# EasyEDA Pro project ProPrj_openfpv.epro

# Schematic Schematic1
Board Name: Board1; Create Date: 2025-07-27; Page Name: P1; Project Name: openfpv; Schematic Name: Schematic1; Update Date: 2025-07-27; Company: EasyEDA.com; Page Size: A4; Version: V1.0
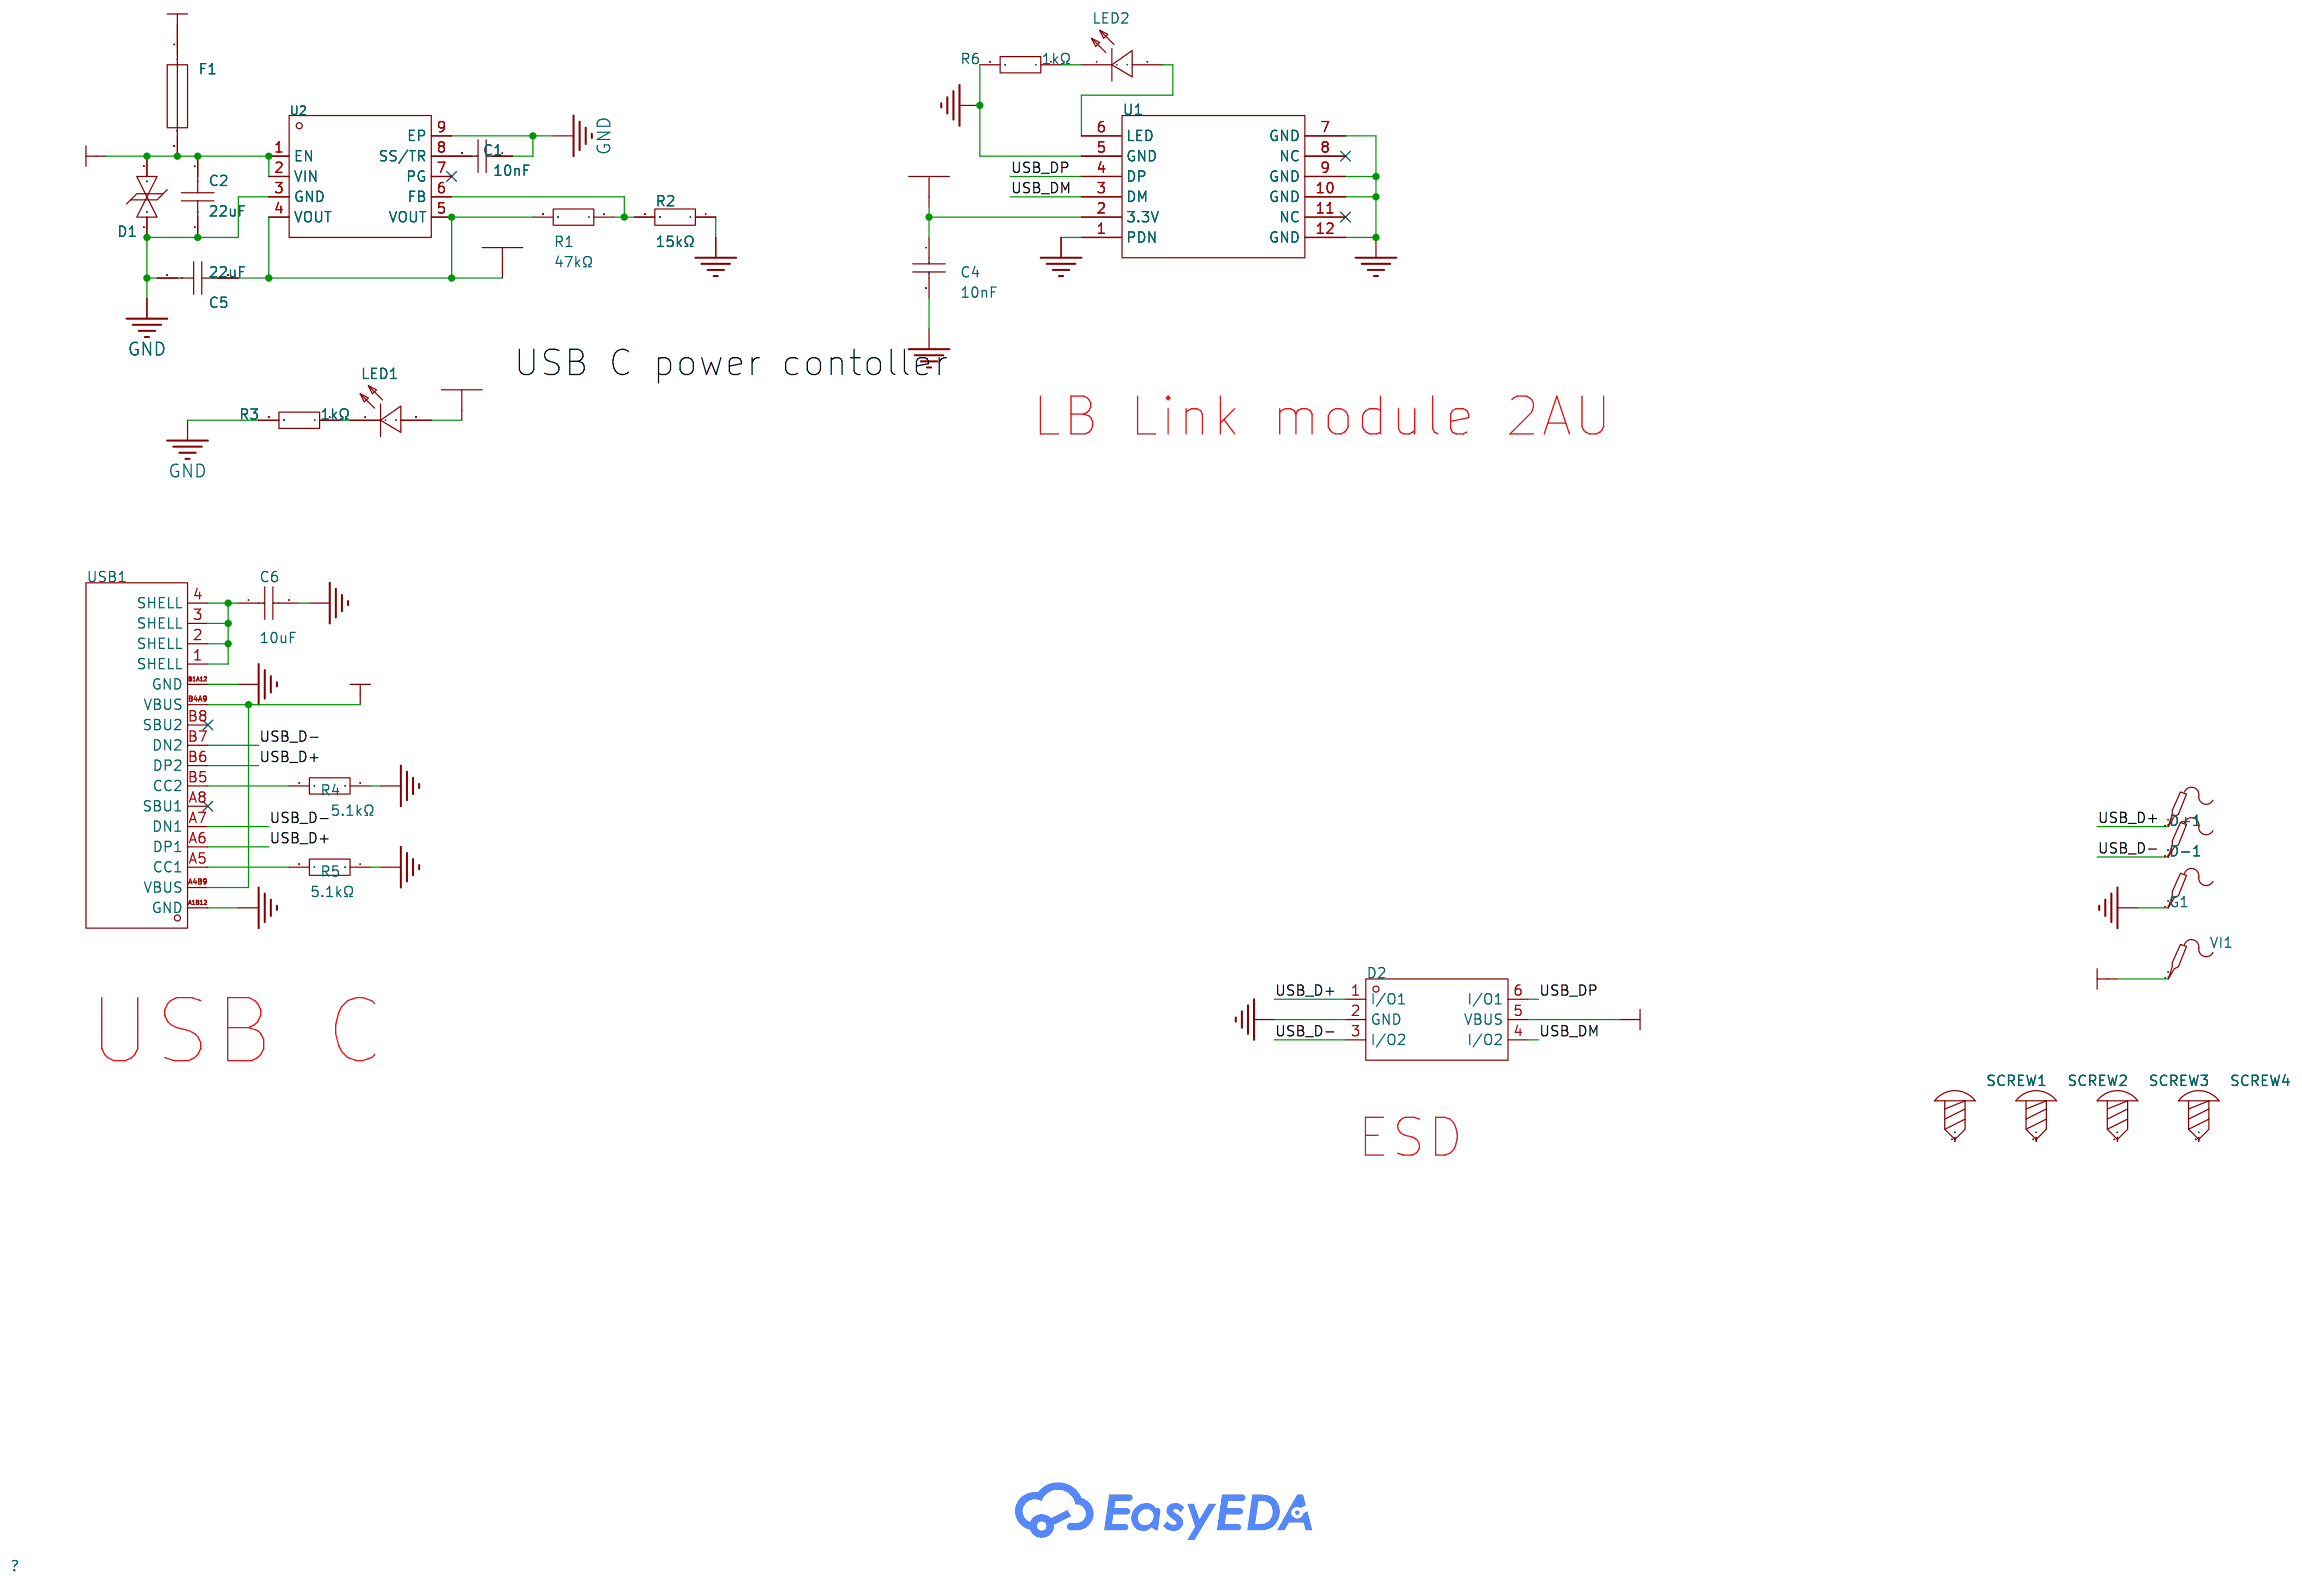
[diagram p0: schematic sheet]

## Parts
C1  10nF  [C0402]
C2  22uF  [C0805]
C4  10nF  [C0402]
C5  22uF  [C0805]
C6  10uF  [C0603]
D1  PESD12VL1BA-N  [SOD-323_L1.8-W1.3-LS2.5-BI]
D2  USBLC6-2P6  [SOT-666-6_L1.6-W1.2-P0.50-LS1.6-BL]
D+1  -  [Test-Point-0.5mm]
D-1  -  [Test-Point-0.5mm]
F1  BSMD0805-075-12V  [F0805]
G1  -  [Test-Point-0.5mm]
LED1  NCD0603R1  [LED0603-RD_RED]
LED2  NCD0603G1  [LED0603-RD]
R1  47kΩ  [R0402]
R2  15kΩ  [R0402]
R3  1kΩ  [R0402]
R4  5.1kΩ  [R0603]
R5  5.1kΩ  [R0603]
R6  1kΩ  [R0402]
SCREW1  -  [M2螺丝]
SCREW2  -  [M2螺丝]
SCREW3  -  [M2螺丝]
SCREW4  -  [M2螺丝]
U1  -  [BL-R8812AF1-C]
U2  TPS82130SILR  [USIP-8_L3.0-W2.8-P0.65-TL-EP]
USB1  TYPE-C16PIN  [USB-C-SMD_TYPE-C16PIN]
VI1  -  [Test-Point-0.5mm]

## Library data of the parts
C1 C4 = CL05B103KB5NNNC: 容值:10nF;精度:±10%;额定电压:50V;材质(温度系数):X7R;; LCSC Part Name: 10nF ±10% 50V; Supplier Part: C15195; Manufacturer: SAMSUNG(三星); Supplier Footprint: 0402; JLCPCB Part Class: Basic Part; Datasheet: https://atta.szlcsc.com/upload/public/pdf/source/20160218/1457707763339.pdf; Supplier: LCSC; Tolerance: ±10%; Voltage Rated: 50V; Temperature Coefficient: X7R
C2 C5 = CL21A226MAQNNNE: 容值:22uF;精度:±20%;额定电压:25V;材质(温度系数):X5R;; LCSC Part Name: 22uF ±20% 25V; Supplier Part: C45783; Manufacturer: SAMSUNG(三星); Supplier Footprint: 0805; JLCPCB Part Class: Basic Part; Datasheet: https://atta.szlcsc.com/upload/public/pdf/source/20160218/1457707763339.pdf; Supplier: LCSC; Tolerance: ±20%; Voltage Rated: 25V; Temperature Coefficient: X5R; Rated Current: 1.4A; Saturation Current (Isat): 1.6A; DC Resistance (DCR): 176mΩ
C6 = CC0603MRX5R6BB106: 容值:10uF;精度:±20%;额定电压:10V;材质(温度系数):X5R;; LCSC Part Name: 10uF ±20% 10V; Supplier Part: C109453; Manufacturer: YAGEO(国巨); Supplier Footprint: 0603; JLCPCB Part Class: Extended Part; Datasheet: https://atta.szlcsc.com/upload/public/pdf/source/20180326/C109453_72B4C2260F588BCE3D54F60D5FB06765.pdf; Supplier: LCSC; Tolerance: ±20%; Voltage Rated: 10V; Temperature Coefficient: X5R
D1 = PESD12VL1BA-N: 极性:双向;反向截止电压(Vrwm):12V;最大钳位电压:26V;峰值脉冲电流(Ipp)@10/1000us:10A;击穿电压:13.3V;; LCSC Part Name: 双向ESD; Supplier Part: C314261; Manufacturer: BORN(伯恩半导体); Supplier Footprint: SOD-323; Datasheet: https://atta.szlcsc.com/upload/public/pdf/source/20181015/C314261_4290A578F6A9FDD8EB59F3EEFCEB14F5.pdf; Supplier: LCSC; polarity: 双向; Reverse Stand-Off Voltage (Vrwm): 12V; Maximum Clamping Voltage: 26V; Peak Pulse Current (Ipp)@10/1000us: 10A; Breakdown Voltage: 13.3V; Type: ESD
D2 = USBLC6-2P6_C2827693: 极性：Unidirectional 反向关断电压（典型值）：5.25V 击穿电压（最小值）：6V 箝位电压：17V 峰值脉冲电流（10/1000us）：4A 二极管阵列 TVS USB2 二极管类型: 单向TVS 钳位电压 最大: 17V 二极管封装形式: SOT-666; LCSC Part Name: MSL=3; Supplier Part: C2827693; Manufacturer: TECH PUBLIC(台舟); Supplier Footprint: SOT-666-6; JLCPCB Part Class: 扩展库; Datasheet: https://atta.szlcsc.com/upload/public/pdf/source/20210810/36353A9194EA9F4E33F8AE18BE051AEA.pdf; Supplier: LCSC
D+1 D-1 G1 VI1 = Test-Point: Test Point 测试点
F1 = BSMD0805-075-12V: 最大电压:12V;最大电流:40A;保持电流:750mA;跳闸电流:1.5A;; LCSC Part Name: 12V 750mA 0805自恢复; Supplier Part: C883111; Manufacturer: BHFUSE(佰宏); Supplier Footprint: 0805; JLCPCB Part Class: 扩展库; Datasheet: https://atta.szlcsc.com/upload/public/pdf/source/20230512/7A46D6CD923C15CBB98FD769C08EDD80.pdf; Supplier: LCSC; Operating Voltage (Max): 12V; Current Rating (Max): 40A; Hold Current: 750mA; Trip Current: 1.5A; Power Dissipation: 600mW; Resistance - Initial (Ri) (Min): 70mΩ; Resistance - Post Trip (R1) (Max): 385mΩ; Maximum Time to Trip: 200ms; Operating Temperature: -40℃~+85℃
LED1 = NCD0603R1_C84263: 灯头类型:-;发光颜色:红色;正向电压(VF):1.6V~2.6V;功率:65mW;正向电流:20mA;主波长:615nm~630nm;二极管配置:独立二极管;透镜颜色:无色透明透镜;色温:-;发光强度:80mcd~220mcd;发光角度:130°;载带方式:-;工作温度:-30℃~+85℃;; Supplier Part: C84263; Manufacturer: 国星光电; Supplier Footprint: 0603; JLCPCB Part Class: Extended Part; Datasheet: https://atta.szlcsc.com/upload/public/pdf/source/20200820/C84263_DABC6A75E58F576973B407FDBA283D60.pdf; Supplier: LCSC; Emitted Color: 红色; Forward Voltage (VF): 1.6V~2.6V; Power Dissipation: 65mW; Forward Current: 20mA; Dominant Wavelength: 615nm~630nm; Diode Configuration: 独立二极管; Lens Color: 无色透明透镜; Luminous Intensity: 80mcd~220mcd; Viewing Angle: 130°; Operating Temperature: -30℃~+85℃
LED2 = NCD0603G1: 发光颜色:翠绿色;正向电压(VF):2.6V~3.6V;功率:72mW;正向电流:10mA;主波长:515nm~530nm;透镜颜色:无色透明透镜;发光强度:330mcd~900mcd;发光角度:130°;工作温度:-30℃~+85℃;; Supplier Part: C84267; Manufacturer: 国星光电; Supplier Footprint: 0603; JLCPCB Part Class: Extended Part; Datasheet: https://atta.szlcsc.com/upload/public/pdf/source/20200820/C84267_04BA7703640BAC111D09F5EFB971FBF3.pdf; Supplier: LCSC; Emitted Color: 翠绿色; Forward Voltage (VF): 2.6V~3.6V; Power Dissipation: 72mW; Forward Current: 10mA; Dominant Wavelength: 515nm~530nm; Lens Color: 无色透明透镜; Luminous Intensity: 330mcd~900mcd; Viewing Angle: 130°; Operating Temperature: -30℃~+85℃; Peak Wavelength: 591nm
R1 = 0402WGF4702TCE: 电阻类型:厚膜电阻;阻值:47kΩ;精度:±1%;功率:62.5mW;最大工作电压:50V;温度系数:±100ppm/℃;; LCSC Part Name: 47kΩ ±1% 62.5mW 厚膜电阻; Supplier Part: C25792; Manufacturer: UNI-ROYAL(厚声); Supplier Footprint: 0402; JLCPCB Part Class: Basic Part; Datasheet: https://atta.szlcsc.com/upload/public/pdf/source/20200306/C422600_1E6D84923E4A46A82E41ADD87F860B5C.pdf; Supplier: LCSC; Type: 厚膜电阻; Tolerance: ±1%; Power(Watts): 62.5mW; Overload Voltage (Max): 50V; Temperature Coefficient: ±100ppm/℃; Operating Temperature Range: -55℃~+155℃; Voltage Rated: 50V
R2 = 0402WGF1502TCE: 电阻类型:厚膜电阻;阻值:15kΩ;精度:±1%;功率:62.5mW;最大工作电压:50V;温度系数:±100ppm/℃;; LCSC Part Name: 15kΩ ±1% 62.5mW 厚膜电阻; Supplier Part: C25756; Manufacturer: UNI-ROYAL(厚声); Supplier Footprint: 0402; JLCPCB Part Class: Basic Part; Datasheet: https://atta.szlcsc.com/upload/public/pdf/source/20200306/C422600_1E6D84923E4A46A82E41ADD87F860B5C.pdf; Supplier: LCSC; Type: 厚膜电阻; Tolerance: ±1%; Power(Watts): 62.5mW; Overload Voltage (Max): 50V; Temperature Coefficient: ±100ppm/℃; Operating Temperature Range: -55℃~+155℃; Voltage Rated: 50V
R3 R6 = 0402WGF1001TCE: 电阻类型:厚膜电阻;阻值:1kΩ;精度:±1%;功率:62.5mW;最大工作电压:50V;温度系数:±100ppm/℃;; LCSC Part Name: 1kΩ ±1% 62.5mW 厚膜电阻; Supplier Part: C11702; Manufacturer: UNI-ROYAL(厚声); Supplier Footprint: 0402; JLCPCB Part Class: Basic Part; Datasheet: https://atta.szlcsc.com/upload/public/pdf/source/20200306/C422600_1E6D84923E4A46A82E41ADD87F860B5C.pdf; Supplier: LCSC; Type: 厚膜电阻; Tolerance: ±1%; Power(Watts): 62.5mW; Overload Voltage (Max): 50V; Temperature Coefficient: ±100ppm/℃; Operating Temperature Range: -55℃~+155℃; Voltage Rated: 50V
R4 R5 = AC0603FR-075K1L: 电阻类型:厚膜电阻;阻值:5.1kΩ;精度:±1%;功率:100mW;; LCSC Part Name: 5.1kΩ ±1% 100mW; Supplier Part: C125891; Manufacturer: YAGEO(国巨); Supplier Footprint: 0603; JLCPCB Part Class: Extended Part; Datasheet: https://atta.szlcsc.com/upload/public/pdf/source/20171221/C125891_15138310074731195201.pdf; Supplier: LCSC; Type: 厚膜电阻; Tolerance: ±1%; Power(Watts): 100mW; Temperature Coefficient: ±100ppm/℃; Overload Voltage (Max): 75V; Operating Temperature Range: -55℃~+155℃
SCREW1-SCREW4 = M2螺丝: Supplier Footprint: 插件
U1 = BL-R8812AF1
U2 = TPS82130SILR: 输入电压(DC):3V~17V;输出电压:900mV~6V;输出电流(最大值):3A;功能类型:-;; Supplier Part: C473914; Manufacturer: TI(德州仪器); Supplier Footprint: USIP-8; JLCPCB Part Class: 扩展库; Datasheet: https://www.ti.com/cn/lit/gpn/tps82130; Supplier: LCSC; Input Voltage(DC): 3V~17V; Output Voltage: 900mV~6V; Output Current (Max): 3A; Output Channel: 1
USB1 = TYPE-C16PIN: 连接器类型:Type-C;标准:-;公母:母;端口数量:1;触点数量:16P;安装方式:卧贴;额定电流 - 电源:3A;工作温度范围:-40℃~+85℃;; LCSC Part Name: Type-C 母 卧贴; Supplier Part: C393939; Manufacturer: SHOU HAN(首韩); Supplier Footprint: SMD; JLCPCB Part Class: 扩展库; Datasheet: https://atta.szlcsc.com/upload/public/pdf/source/20190521/C393939_7B9043D4CF1026AF443AB60D91FBCD5C.pdf; Supplier: LCSC; Connector Type: Type-C; Gender: 母; Number of Ports: 1; Number of Contacts: 16P; Mounting Style: 卧贴; Current Rating - Power (Max): 3A; Operating Temperature Range: -40℃~+85℃

## Nets
3V3: C4.1 C5.2 LED1.2(A) R1.2 U1.2(3.3V) U2.4(VOUT) U2.5(VOUT)
GND: C1.1 C2.2 C4.2 C5.1 C6.1 D1.1 D2.2(GND) G1.1 R2.1 R3.2 R4.1 R5.1 R6.2 U1.1(PDN) U1.5(GND) U1.7(GND) U1.9(GND) U1.10(GND) U1.12(GND) U2.3(GND) U2.9(EP) USB1.A1B12(GND) USB1.B1A12(GND)
VIN_CON: F1.1 VI1.1
USB_D+: D2.1(I/O1) D+1.1 USB1.A6(DP1) USB1.B6(DP2)
USB_D-: D2.3(I/O2) D-1.1 USB1.A7(DN1) USB1.B7(DN2)
USB_DM: D2.4(I/O2) U1.3(DM)
USB_DP: D2.6(I/O1) U1.4(DP)
USB_VBUS: C2.1 D1.2 D2.5(VBUS) F1.2 U2.1(EN) U2.2(VIN) USB1.A4B9(VBUS) USB1.B4A9(VBUS)
$1N1281: LED1.1(K) R3.1
$1N1283: R1.1 R2.2 U2.6(FB)
$1N1284: C1.2 U2.8(SS/TR)
$1N1301: R5.2 USB1.A5(CC1)
$1N1302: R4.2 USB1.B5(CC2)
$1N1320: LED2.1(K) R6.1
$1N1321: LED2.2(A) U1.6(LED)
$1N1322: C6.2 USB1.1(SHELL) USB1.2(SHELL) USB1.3(SHELL) USB1.4(SHELL)

Not connected (* = marked no-connect by the designer): SCREW1 1; SCREW2 1; SCREW3 1; SCREW4 1; U1 8(NC)* 11(NC)*; U2 7(PG)*; USB1 A8(SBU1)* B8(SBU2)*

## Notes on the sheet
- USB C power contoller
- LB Link module 2AU
- USB C
- ESD

# Schematic Schematic2
Board Name: air; Create Date: 2025-07-31; Page Name: P1; Project Name: openfpv; Schematic Name: Schematic2; Update Date: 2025-07-31; Company: EasyEDA.com; Page Size: A4; Version: V1.0
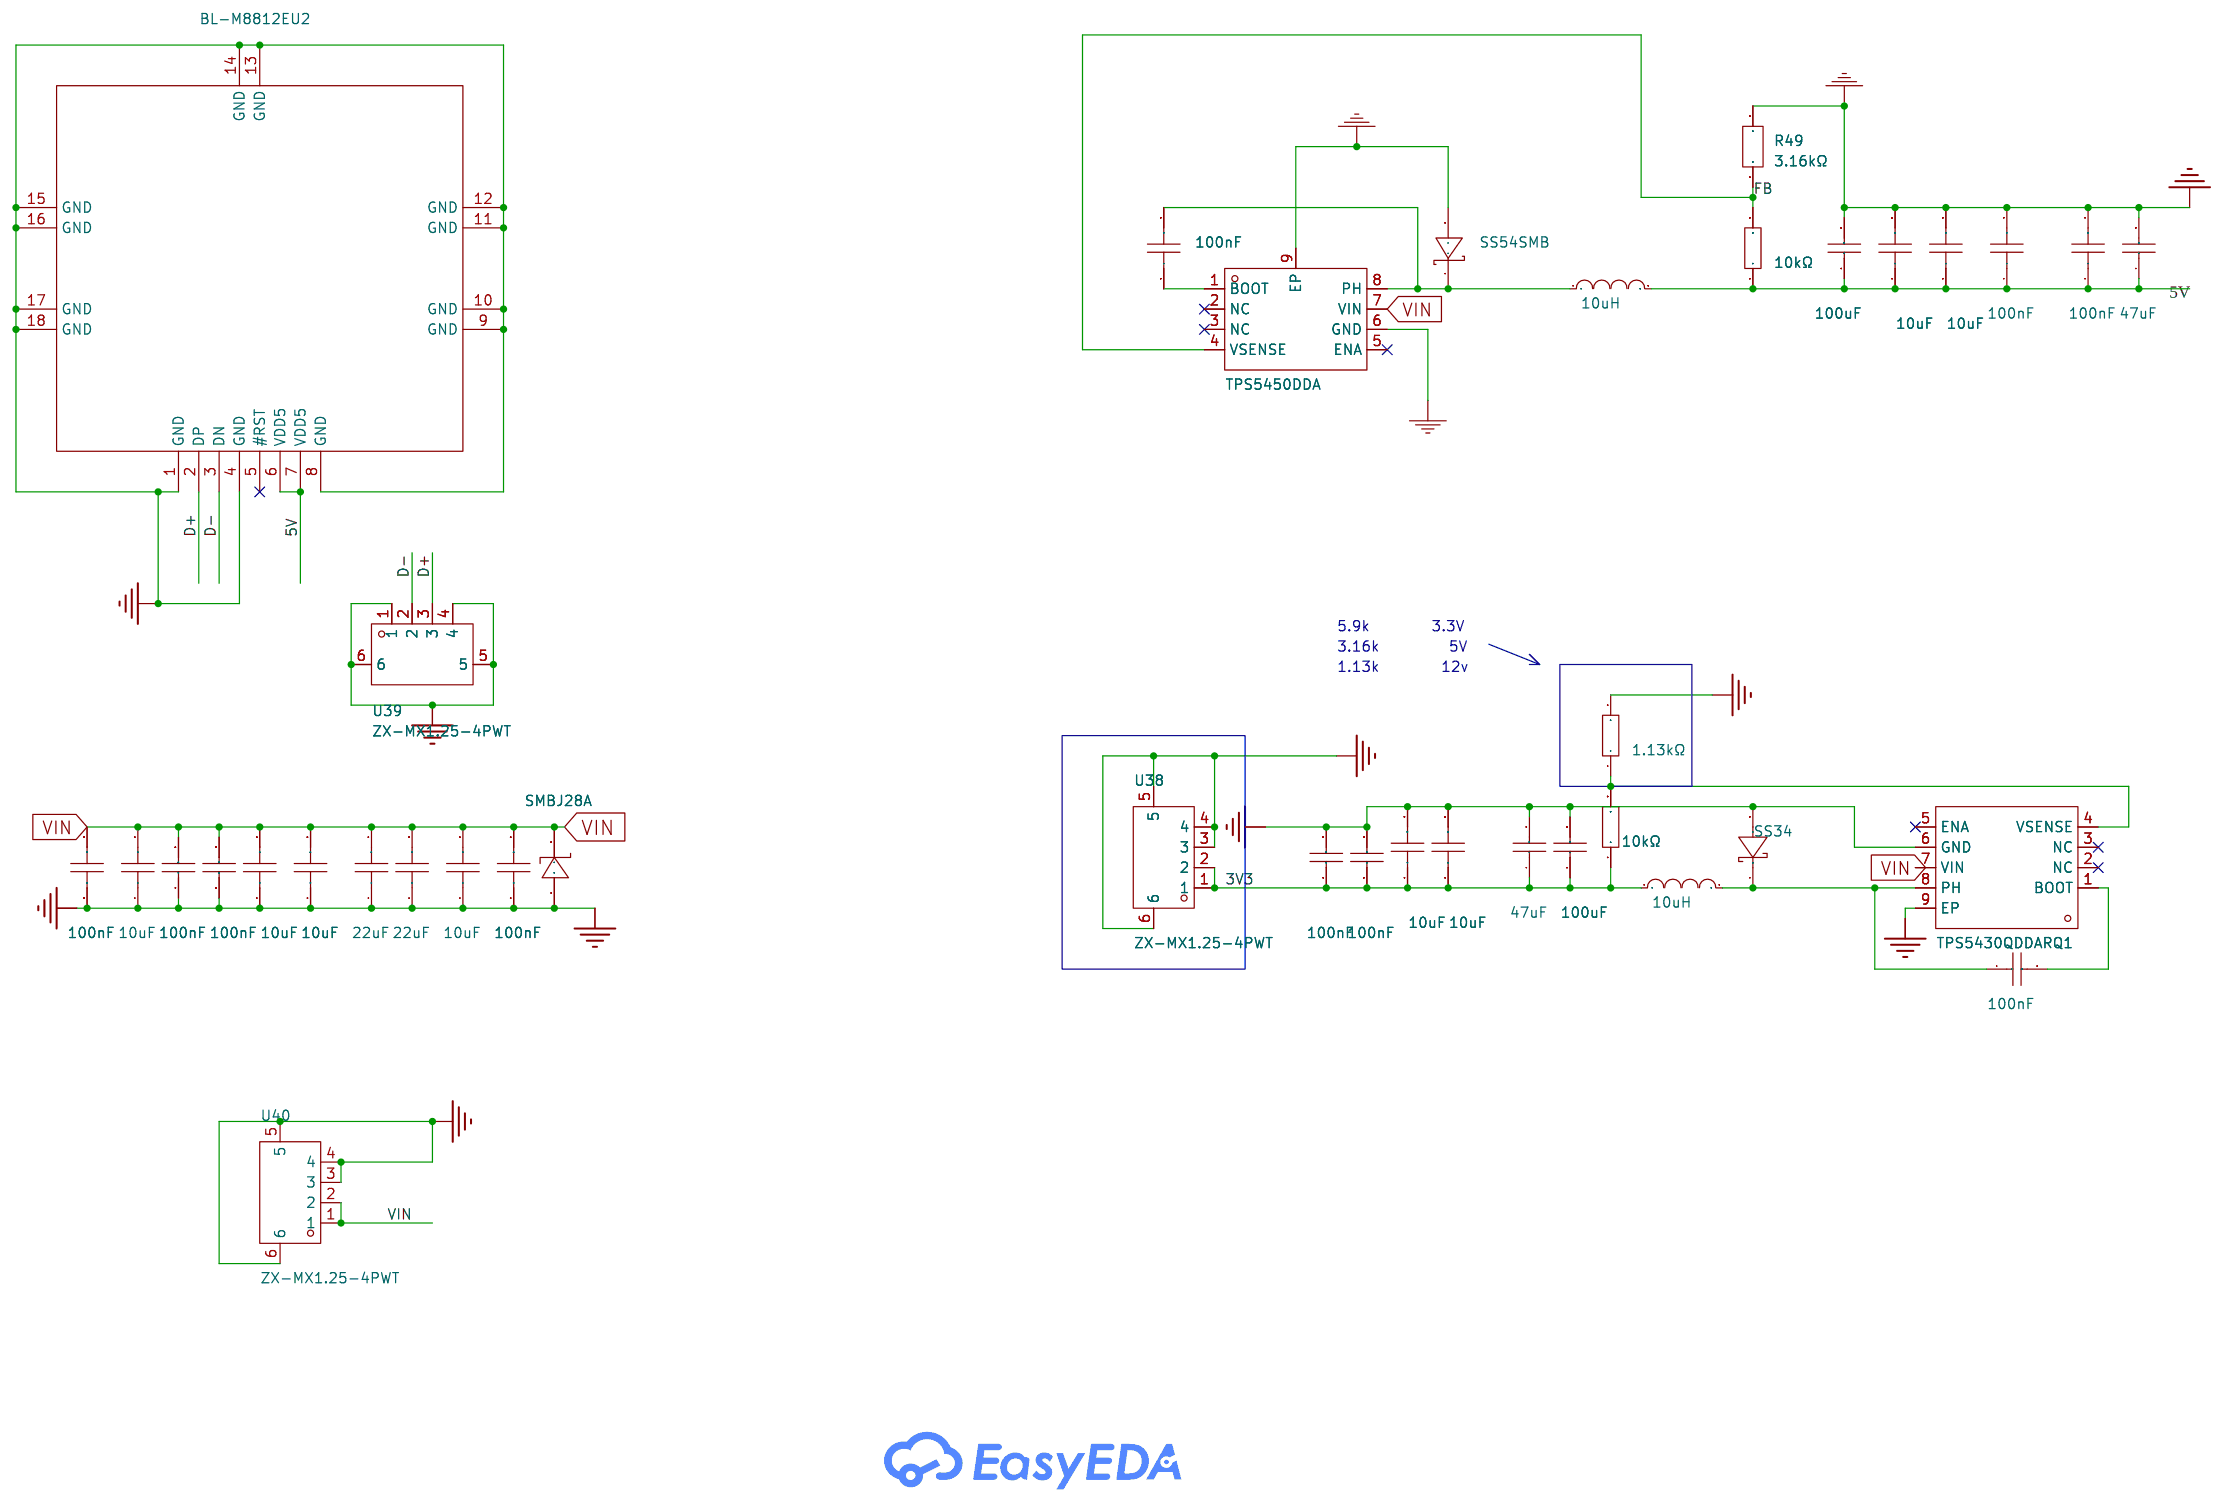
[diagram p1: schematic sheet]

## Parts
C100  100nF  [C0603]
C143  100nF  [C0603]
C152  100nF  [C0603]
C157  100nF  [C0603]
C158  100nF  [C0603]
C159  47uF  [C0603]
C161  22uF  [C0805]
C167  100nF  [C0603]
C176  10uF  [C0603]
C177  10uF  [C0603]
C178  100uF  [C1206]
C179  100uF  [C1206]
C186  10uF  [C0603]
C187  10uF  [C0603]
C189  100nF  [C0603]
C191  22uF  [C0805]
C192  100nF  [C0805]
C193  100nF  [C0805]
C196  10uF  [C0805]
C197  10uF  [C0805]
C199  100nF  [C0603]
C200  47uF  [C0603]
C201  10uF  [C0603]
D3  SMBJ28A  [SMB_L4.6-W3.6-LS5.3-L-FD]
D4  SS54SMB  [SMB_L4.6-W3.6-LS5.3-RD]
D5  SS34  [SMA_L4.3-W2.5-LS5.0-RD]
L11  10uH  [IND-SMD_L5.4-W5.2_FXL0530]
L12  10uH  [IND-SMD_L5.4-W5.2_FXL0530]
R47  10kΩ  [R0603]
R48  10kΩ  [R0603]
R49  3.16kΩ  [R0603]
R50  1.13kΩ  [R0603]
U11  TPS5450DDA  [SOP-8_L4.9-W3.9-P1.27-LS6.0-TL-EP-1]
U16  BL-M8812EU2  [BL-M8812EU2]
U28  TPS5430QDDARQ1  [SOPOWERPAD-8_L4.9-W3.9-P1.27-LS6.0-BL-EP]
U38  ZX-MX1.25-4PWT  [CONN-SMD_4P-P1.25-MX1.25-4P-WT]
U39  ZX-MX1.25-4PWT  [CONN-SMD_4P-P1.25-MX1.25-4P-WT]
U40  ZX-MX1.25-4PWT  [CONN-SMD_4P-P1.25-MX1.25-4P-WT]
U41  10uF  [C0603]

## Library data of the parts
C100 C157 C158 = CC0603KRX7R9BB104: 容值:100nF;精度:±10%;额定电压:50V;材质(温度系数):X7R;; LCSC Part Name: 100nF ±10% 50V; Supplier Part: C14663; Manufacturer: YAGEO(国巨); Supplier Footprint: 0603; JLCPCB Part Class: 基础库; Datasheet: https://atta.szlcsc.com/upload/public/pdf/source/20180910/C282072_33301C7F631E79921B82A8DAC6BCC5B3.pdf; Supplier: LCSC; Tolerance: ±10%; Voltage Rated: 50V; Temperature Coefficient: X7R
C143 C152 C167 = 0603B104K500NT: 容值:100nF;精度:±10%;额定电压:50V;材质(温度系数):X7R;; LCSC Part Name: 100nF ±10% 50V; Supplier Part: C30926; Manufacturer: FH(风华); Supplier Footprint: 0603; JLCPCB Part Class: 扩展库; Datasheet: https://atta.szlcsc.com/upload/public/pdf/source/20170923/C30926_1506149436298988724.pdf; Supplier: LCSC; Tolerance: ±10%; Voltage Rated: 50V; Temperature Coefficient: X7R
C159 C200 = GRM188R60J476ME15D: 容值:47uF;精度:±20%;额定电压:6.3V;材质(温度系数):X5R;; LCSC Part Name: 47uF ±20% 6.3V; Supplier Part: C140782; Manufacturer: muRata(村田); Supplier Footprint: 0603; JLCPCB Part Class: 扩展库; Datasheet: https://atta.szlcsc.com/upload/public/pdf/source/20171113/C140782_15105612981581115778.pdf; Supplier: LCSC; Tolerance: ±20%; Voltage Rated: 6.3V; Temperature Coefficient: X5R
C161 C191 = CGA0805X5R226M350MT: 容值:22uF;精度:±20%;额定电压:35V;材质(温度系数):X5R;; LCSC Part Name: 22uF ±20% 35V; Supplier Part: C6119901; Manufacturer: HRE(芯声); Supplier Footprint: 0805; JLCPCB Part Class: Extended Part; Supplier: LCSC; Tolerance: ±20%; Voltage Rated: 35V; Temperature Coefficient: X5R
C176 C177 C186 C187 C201 = CL10A106KP8NNNC: 容值:10uF;精度:±10%;额定电压:10V;材质(温度系数):X5R;; LCSC Part Name: 10uF ±10% 10V; Supplier Part: C19702; Manufacturer: SAMSUNG(三星); Supplier Footprint: 0603; JLCPCB Part Class: 基础库; Datasheet: https://atta.szlcsc.com/upload/public/pdf/source/20160218/1457707763339.pdf; Supplier: LCSC; Tolerance: ±10%; Voltage Rated: 10V; Temperature Coefficient: X5R
C178 C179 = CL31A107MQHNNNE: 容值:100uF;精度:±20%;额定电压:6.3V;材质(温度系数):X5R;; LCSC Part Name: 100uF ±20% 6.3V; Supplier Part: C15008; Manufacturer: SAMSUNG(三星); Supplier Footprint: 1206; JLCPCB Part Class: 基础库; Datasheet: https://atta.szlcsc.com/upload/public/pdf/source/20160218/1457707763339.pdf; Supplier: LCSC; Tolerance: ±20%; Voltage Rated: 6.3V; Temperature Coefficient: X5R
C189 C199 = CGA0603X7R104K500JT: 容值:100nF;精度:±10%;额定电压:50V;材质(温度系数):X7R;; LCSC Part Name: 100nF ±10% 50V; Supplier Part: C6119867; Manufacturer: HRE(芯声); Supplier Footprint: 0603; JLCPCB Part Class: 扩展库; Supplier: LCSC; Tolerance: ±10%; Voltage Rated: 50V; Temperature Coefficient: X7R
C192 C193 = CC0805KRX7R9BB104: 容值:100nF;精度:±10%;额定电压:50V;材质(温度系数):X7R;; LCSC Part Name: 100nF ±10% 50V; Supplier Part: C49678; Manufacturer: YAGEO(国巨); Supplier Footprint: 0805; JLCPCB Part Class: 基础库; Datasheet: https://atta.szlcsc.com/upload/public/pdf/source/20180224/C181747_15194369449651363981.pdf; Supplier: LCSC; Tolerance: ±10%; Voltage Rated: 50V; Temperature Coefficient: X7R
C196 C197 = CGA0805X5R106K350MT: 容值:10uF;精度:±10%;额定电压:35V;材质(温度系数):X5R;; LCSC Part Name: 10uF ±10% 35V; Supplier Part: C6119888; Manufacturer: HRE(芯声); Supplier Footprint: 0805; JLCPCB Part Class: 扩展库; Supplier: LCSC; Tolerance: ±10%; Voltage Rated: 35V; Temperature Coefficient: X5R
D3 = SMBJ28A: 极性:Unidirectional;峰值脉冲电流（10/1000us）:13.2A;箝位电压:45.4V;击穿电压（最小值）:31.1V;反向关断电压（典型值）:28V;; Supplier Part: C356769; Manufacturer: JJW(捷捷微); Supplier Footprint: SMB(DO-214AA); JLCPCB Part Class: 扩展库; Datasheet: https://atta.szlcsc.com/upload/public/pdf/source/20181226/C356769_111367A690C2F4EEBB1E8F2BF22E2686.pdf; Supplier: LCSC
D4 = SS54SMB: schottky,5A 40V VF&lt;0.55V DO-214AA SMB; LCSC Part Name: SS54 SMB; Supplier Part: C511854; Manufacturer: BORN(伯恩半导体); Supplier Footprint: SMB; JLCPCB Part Class: 扩展库; Datasheet: https://atta.szlcsc.com/upload/public/pdf/source/20200413/C511854_F7D668554D39129E820C7896E4694DA5.pdf; Supplier: LCSC
D5 = SS34_C727060: 二极管配置:独立式;正向压降(Vf):550mV@3A;直流反向耐压(Vr):40V;平均整流电流(Io):3A;; LCSC Part Name: 电压:40V 电流:3A; Supplier Part: C727060; Manufacturer: TWGMC(台湾迪嘉); Supplier Footprint: SMA(DO-214AC); JLCPCB Part Class: 扩展库; Datasheet: https://atta.szlcsc.com/upload/public/pdf/source/20200828/C727059_6599B6CAC5F3238B9C33E46794659DBE.pdf; Supplier: LCSC; Diode Configuration: 独立式; Forward Voltage (Vf@If): 550mV@3A; Reverse Voltage (Vr): 40V; Average Rectified Current (Io): 3A; Reverse Leakage Current (Ir): 500uA@40V
L11 L12 = FXL0530-100-M: 电感值:10uH;精度:±20%;额定电流:3.2A;饱和电流(Isat):3.5A;类型:一体成型电感;; LCSC Part Name: 10uH ±20% 3.5A; Supplier Part: C177248; Manufacturer: cjiang(长江微电); Supplier Footprint: SMD,5.2x5.4mm; JLCPCB Part Class: 扩展库; Datasheet: https://atta.szlcsc.com/upload/public/pdf/source/20230516/4BF6F9C76E81720F52A39ED5FFFA18B4.pdf; Supplier: LCSC; Tolerance: ±20%; Rated Current: 3.2A; Saturation Current (Isat): 3.5A; DC Resistance (DCR): 125mΩ; Type: 一体成型电感
R47 R48 = 0603WAF1002T5E: 电阻类型:厚膜电阻;阻值:10kΩ;精度:±1%;功率:100mW;最大工作电压:75V;温度系数:±100ppm/℃;; LCSC Part Name: 厚膜电阻 10kΩ ±1% 100mW; Supplier Part: C25804; Manufacturer: UNI-ROYAL(厚声); Supplier Footprint: 0603; JLCPCB Part Class: 基础库; Datasheet: https://atta.szlcsc.com/upload/public/pdf/source/20200306/C422600_1E6D84923E4A46A82E41ADD87F860B5C.pdf; Supplier: LCSC; Type: 厚膜电阻; Tolerance: ±1%; Power(Watts): 100mW; Overload Voltage (Max): 75V; Temperature Coefficient: ±100ppm/℃; Operating Temperature Range: -55℃~+155℃
R49 = FRC0603F3161TS: 电阻类型:厚膜电阻;阻值:3.16kΩ;精度:±1%;功率:100mW;最大工作电压:75V;温度系数:±100ppm/℃;; LCSC Part Name: 3.16kΩ ±1% 100mW 厚膜电阻; Supplier Part: C2930087; Manufacturer: FOJAN(富捷); Supplier Footprint: 0603; JLCPCB Part Class: 扩展库; Datasheet: https://atta.szlcsc.com/upload/public/pdf/source/20211221/925EC7D7225764EE0046F22065062C87.pdf; Supplier: LCSC; Type: 厚膜电阻; Tolerance: ±1%; Power(Watts): 100mW; Overload Voltage (Max): 75V; Temperature Coefficient: ±100ppm/℃; Operating Temperature Range: -55℃~+155℃
R50 = 0603WAF5901T5E: 电阻类型:厚膜电阻;阻值:5.9kΩ;精度:±1%;功率:100mW;最大工作电压:75V;温度系数:±100ppm/℃;; LCSC Part Name: 5.9kΩ ±1% 100mW 厚膜电阻; Supplier Part: C23071; Manufacturer: UNI-ROYAL(厚声); Supplier Footprint: 0603; JLCPCB Part Class: 扩展库; Datasheet: https://atta.szlcsc.com/upload/public/pdf/source/20200306/C422600_1E6D84923E4A46A82E41ADD87F860B5C.pdf; Supplier: LCSC; Type: 厚膜电阻; Tolerance: ±1%; Power(Watts): 100mW; Overload Voltage (Max): 75V; Temperature Coefficient: ±100ppm/℃; Operating Temperature Range: -55℃~+155℃
U11 = TPS5450DDA: 功能类型:降压型;同步整流:否;输出类型:可调;输出通道数:1;拓扑结构:降压式;输入电压:5.5V~36V;输出电压:1.221V~31.32V;输出电流(最大值):5A;开关频率:500kHz;工作温度:-40℃~+125℃@(TJ);; LCSC Part Name: 降压型 Vin=5.5V~36V Vout=1.221V~31.32V 5A; Supplier Part: C1355315; Manufacturer: TI(德州仪器); Supplier Footprint: Power-Pad-SO-8; JLCPCB Part Class: 扩展库; Supplier: LCSC; Function: 降压型; Synchronous Rectification: 否; Output Type: 可调; Number of Outputs: 1; Topology: 降压式; Input Voltage: 5.5V~36V; Output Voltage: 1.221V~31.32V; Output Current (Max): 5A; Switching Frequency: 500kHz; Operating Temperature: -40℃~+125℃@(TJ)
U16 = BL-M8812EU2: Supplier: 某宝; link: https://www.b-link.net.cn/product_36_321.html; _: 3
U28 = TPS5430QDDARQ1: 功能类型:降压型;输出类型:可调;输入电压:5.5V~36V;输出电压:1.221V~32.04V;输出电流(最大值):3A;; Supplier Part: C388178; Manufacturer: TI(德州仪器); Supplier Footprint: SOP-8-EP; JLCPCB Part Class: 扩展库; Datasheet: https://www.ti.com/cn/lit/gpn/tps5430-q1; Supplier: LCSC; Function: 降压型; Output Type: 可调; Input Voltage: 5.5V~36V; Output Voltage: 1.221V~32.04V; Output Current (Max): 3A; Switching Frequency: 500kHz; Operating Temperature: -40℃~+125℃@(TJ); Synchronous Rectification: 否; Number of Outputs: 1; Topology: 降压式; Switch tube (built-in/external): 内置
U38-U40 = ZX-MX1.25-4PWT: 插针结构:1x4P;间距:1.25mm;安装方式:卧贴;参考系列:-;总PIN数:4P;排数:1;每排PIN数:4;行距:-;额定电流:1A;触头材质:黄铜;触头镀层:锡;工作温度范围:-25℃~+85℃;; LCSC Part Name: 1x4P 间距:1.25mm 卧贴; Supplier Part: C7430470; Manufacturer: Megastar(兆星); Supplier Footprint: SMD,P=1.25mm,卧贴; JLCPCB Part Class: 扩展库; Datasheet: https://atta.szlcsc.com/upload/public/pdf/source/20230619/568E7DE8E71AB8D5E62B450F32774D0B.pdf; Supplier: LCSC; Pins Structure: 1x4P; Pitch: 1.25mm; Mounting Style: 卧贴; Number of Pins: 4P; Number of Rows: 1; Number of PINs Per Row: 4; Current Rating (Max): 1A; Contact Material: 黄铜; Contact Plating: 锡; Operating Temperature Range: -25℃~+85℃
U41 = HGC0603R5106M350NTHJ: 容值:10uF;精度:±20%;额定电压:35V;材质(温度系数):X5R;; LCSC Part Name: 10uF ±20% 35V; Supplier Part: C22367827; Manufacturer: Chinocera(华瓷); Supplier Footprint: 0603; JLCPCB Part Class: 扩展库; Datasheet: https://atta.szlcsc.com/upload/public/pdf/source/20240326/08136F0414FFF46DD07E47F2D66E675E.pdf; Supplier: LCSC; Tolerance: ±20%; Voltage Rated: 35V; Temperature Coefficient: X5R

## Nets
3V3: C152.1 C159.1 C167.1 C176.1 C177.1 C179.1 L12.1 R48.1 U38.1 U38.2
5V: C157.1 C158.1 C178.1 C186.1 C187.1 C200.1 L11.2 R47.1 U16.6(VDD5) U16.7(VDD5)
GND: C152.2 C157.2 C158.2 C159.2 C161.1 C167.2 C176.2 C177.2 C178.2 C179.2 C186.2 C187.2 C189.1 C191.1 C192.1 C193.1 C196.1 C197.1 C199.1 C200.2 C201.1 D3.1(A) D4.2(A) D5.2(A) R49.2 R50.2 U11.6(GND) U11.9(EP) U16.1(GND) U16.4(GND) U16.8(GND) U16.9(GND) U16.10(GND) U16.11(GND) U16.12(GND) U16.13(GND) U16.14(GND) U16.15(GND) U16.16(GND) U16.17(GND) U16.18(GND) U28.6(GND) U28.9(EP) U38.3 U38.4 U38.5 U38.6 U39.1 U39.4 U39.5 U39.6 U40.3 U40.4 U40.5 U40.6 U41.1
VIN: C161.2 C189.2 C191.2 C192.2 C193.2 C196.2 C197.2 C199.2 C201.2 D3.2(K) U11.7(VIN) U28.7(VIN) U40.1 U40.2 U41.2
D+: U16.2(DP) U39.3
D-: U16.3(DN) U39.2
FB: R47.2 R49.1 U11.4(VSENSE)
$1N1948: C100.2 D4.1(K) L11.1 U11.8(PH)
$1N1949: C100.1 U11.1(BOOT)
$1N1954: C143.2 U28.1(BOOT)
$1N1955: C143.1 D5.1(C) L12.2 U28.8(PH)
$1N1978: R48.2 R50.1 U28.4(VSENSE)

Not connected (* = marked no-connect by the designer): U11 2(NC)* 3(NC)* 5(ENA)*; U16 5(#RST)*; U28 2(NC)* 3(NC)* 5(ENA)*

## Notes on the sheet
- 5.9k        3.3V
- 3.16k         5V
- 1.13k        12v

# Board PCB1_air
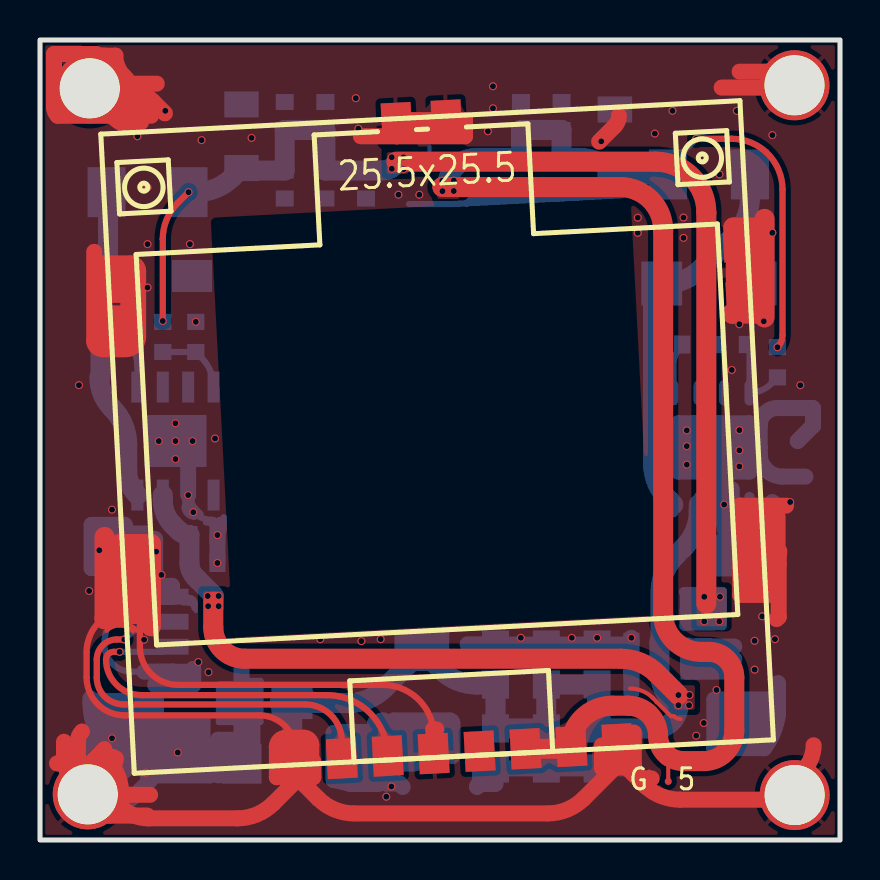
[diagram p2: board, top side]
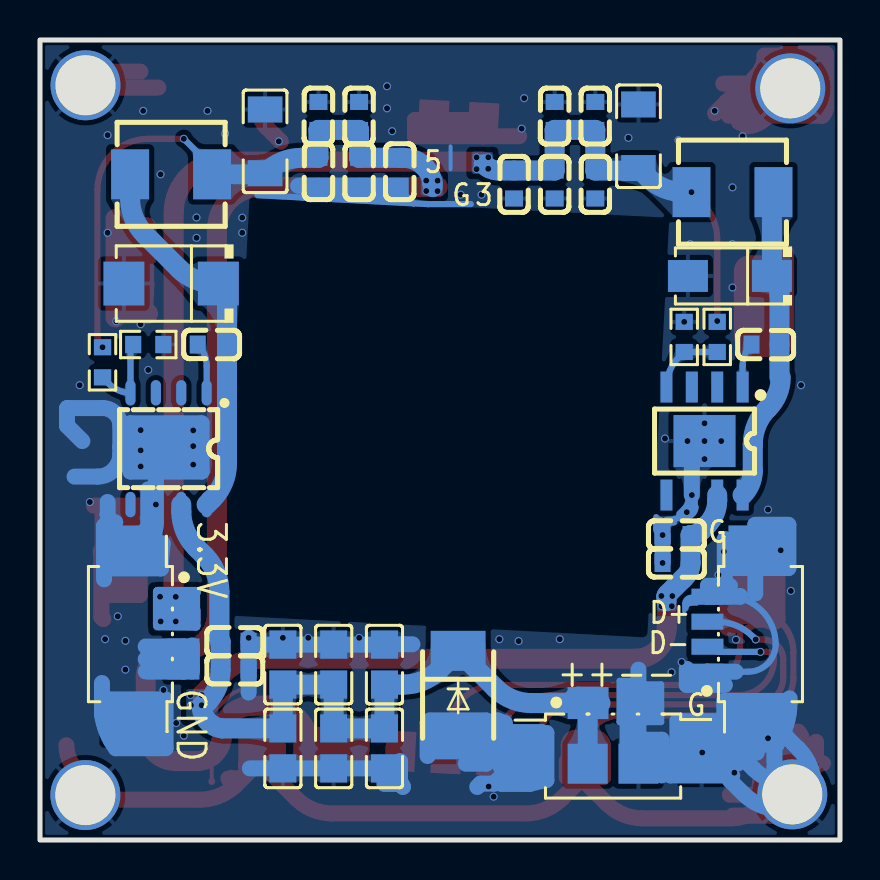
[diagram p3: board, bottom side, seen from below]

Outline 40 x 40 mm; copper layers: Top Layer, Bottom Layer. Coordinates in mm from the lower left corner of the outline.
Outline path: rectangle 0,40 40,0
Stack: Top Layer 0.035mm / Dielectric1 1.51mm FR4 er 4.5 / Bottom Layer 0.035mm

## Design rules (mm)
net D+: DP1
net D-: DP1
template: 自定义配置
spacing copperThickness1oz (default): track to track 0.102, other pairs 0.152 to 0.3
spacing copperThickness2oz: track to track 0.203, other pairs 0.152 to 0.3
track width copperThickness1oz (default): min 0.127, default 0.254, max 2.54
track width copperThickness2oz: min 0.203, default 0.254, max 2.54
differential pair differentialPair (default): width min 0.127, default 0.254, max 2.54; gap min 0.152, default 0.152
via viaSize (default): diameter min 0.4, default 0.4, max 10; hole min 0.3, default 0.3, max 6.3

## Placement (name value [footprint] x y rotation side)
C100  100nF  [C0603]  31.41 24.77 180 bottom
C143  100nF  [C0603]  3.73 24.77 0 bottom
C152  100nF  [C0603]  14.27 32.77 270 bottom
C157  100nF  [C0603]  24.05 33.41 270 bottom
C158  100nF  [C0603]  22.01 33.41 270 bottom
C159  47uF  [C0603]  12.23 32.77 270 bottom
C161  22uF  [C0805]  22.78 4.58 90 bottom
C167  100nF  [C0603]  16.3 32.77 270 bottom
C176  10uF  [C0603]  12.23 36.2 90 bottom
C177  10uF  [C0603]  14.27 36.2 90 bottom
C178  100uF  [C1206]  28.74 34.93 90 bottom
C179  100uF  [C1206]  10.08 35.19 90 bottom
C186  10uF  [C0603]  26.08 36.2 90 bottom
C187  10uF  [C0603]  24.05 36.2 90 bottom
C189  100nF  [C0603]  8.17 15.25 180 bottom
C191  22uF  [C0805]  22.78 8.77 270 bottom
C192  100nF  [C0805]  27.86 4.58 90 bottom
C193  100nF  [C0805]  27.86 8.77 270 bottom
C196  10uF  [C0805]  25.32 4.58 90 bottom
C197  10uF  [C0805]  25.32 8.77 270 bottom
C199  100nF  [C0603]  30.27 9.91 0 bottom
C200  47uF  [C0603]  26.08 33.41 270 bottom
C201  10uF  [C0603]  30.27 8.52 0 bottom
D3  SMBJ28A  [SMB_L4.6-W3.6-LS5.3-L-FD]  19.09 7.25 90 bottom
D4  SS54SMB  [SMB_L4.6-W3.6-LS5.3-RD]  33.44 27.82 0 bottom
D5  SS34  [SMA_L4.3-W2.5-LS5.0-RD]  5.5 28.2 0 bottom
L11  10uH  [IND-SMD_L5.4-W5.2_FXL0530]  33.44 33.28 180 bottom
L12  10uH  [IND-SMD_L5.4-W5.2_FXL0530]  5.38 32.39 180 bottom
NOREF  -  [Pad_e114]  12.62 3.82 0 top
NOREF#2  -  [Pad_e4926]  30.52 2.93 0 top
NOREF#3  -  [Pad_e56]  37.73 2.25 45 top
NOREF#4  -  [Pad_e112]  10.08 3.82 0 top
NOREF#5  -  [Pad_e59]  37.72 37.74 45 top
NOREF#6  -  [Pad_e57]  2.39 2.28 45 top
NOREF#7  -  [Pad_e54]  2.49 37.58 45 top
NOREF#8  -  [Pad_e4924]  31.41 2.93 0 top
R47  10kΩ  [R0603]  36.87 23.88 270 bottom
R48  10kΩ  [R0603]  6.14 25.15 270 bottom
R49  3.16kΩ  [R0603]  34.59 24.77 180 bottom
R50  1.13kΩ  [R0603]  7.79 25.15 90 bottom
U11  TPS5450DDA  [SOP-8_L4.9-W3.9-P1.27-LS6.0-TL-EP-1]  33.57 19.57 270 bottom
U16  -  [BL-M8812EU2]  19.85 20.15 3 top
U28  TPS5430QDDARQ1  [SOPOWERPAD-8_L4.9-W3.9-P1.27-LS6.0-BL-EP]  6.77 19.95 0 bottom
U38  ZX-MX1.25-4PWT  [CONN-SMD_4P-P1.25-MX1.25-4P-WT]  34.08 10.3 270 bottom
U39  ZX-MX1.25-4PWT  [CONN-SMD_4P-P1.25-MX1.25-4P-WT]  5.38 10.3 90 bottom
U40  ZX-MX1.25-4PWT  [CONN-SMD_4P-P1.25-MX1.25-4P-WT]  11.35 5.6 180 bottom
U41  10uF  [C0603]  8.17 13.85 180 bottom

## Footprints (pads in the part's own frame, mm; a bottom-side part is the same pattern mirrored in y, then rotated)
BL-M8812EU2
  rect 1.5x2 smd: 1(-7.9,-15.8) 2(-5.6,-15.8) 3(-3.3,-15.8) 4(-1,-15.8) 5(1.3,-15.8) 6(3.6,-15.8) 7(5.9,-15.8) 8(8.2,-15.8) 13(1.3,15.8) 14(-1.2,15.8)
  rect 2x1.5 smd: 9(15.8,-7.8) 10(15.8,-5.3) 11(15.8,6.2) 12(15.8,8.7) 15(-15.8,8.7) 16(-15.8,6.2) 17(-15.8,-5.5) 18(-15.8,-7.8)
C0603
  rect 0.8x0.9 smd: 1(-0.7,0) 2(0.7,0)
C0805
  rect 1.41x1.35 smd: 1(-1,0) 2(1,0)
C1206
  rect 1.3x1.728 smd: 1(-1.593,0) 2(1.593,0)
CONN-SMD_4P-P1.25-MX1.25-4P-WT
  rect 0.8x1.6 smd: 1(-1.88,1.25) 2(-0.63,1.25) 3(0.62,1.25) 4(1.87,1.25)
  rect 2x2.9 smd: 5(4.43,-1.25) 6(-4.43,-1.25)
IND-SMD_L5.4-W5.2_FXL0530
  rect 1.9x2.5 smd: 1(-2.05,0) 2(2.05,0)
Pad_e54
  round 3.5 hole 3: 1(0,0)
Pad_e56
  round 3.5 hole 3: 3(0,0)
Pad_e57
  round 3.5 hole 3: 4(0,0)
Pad_e59
  round 3.5 hole 3: 1(0,0)
Pad_e112
  rect 2x2 smd far side: 1(0,0)
Pad_e114
  rect 2x2 smd far side: 1(0,0)
Pad_e4924
  round 0.35 smd: 1(0,0)
Pad_e4926
  round 0.35 smd: 1(0,0)
R0603
  rect 0.806x0.864 smd: 1(-0.753,0) 2(0.753,0)
SMA_L4.3-W2.5-LS5.0-RD
  rect 2x1.593 smd: 1(-2.1,0) 2(2.1,0)
SMB_L4.6-W3.6-LS5.3-L-FD
  rect 2x2.743 smd: 1(-2.21,0) 2(2.21,0)
SMB_L4.6-W3.6-LS5.3-RD
  rect 2.047x2.192 smd: 1(-2.361,0) 2(2.361,0)
SOP-8_L4.9-W3.9-P1.27-LS6.0-TL-EP-1
  oval 1.27x0.508 smd: 1(-2.794,1.905) 2(-2.794,0.635) 3(-2.794,-0.635) 4(-2.794,-1.905) 5(2.794,-1.905) 6(2.794,-0.635) 7(2.794,0.635) 8(2.794,1.905)
  rect 2.4x3.3 smd: 9(0,0)
SOPOWERPAD-8_L4.9-W3.9-P1.27-LS6.0-BL-EP
  rect 0.6x1.55 smd: 1(-1.905,-2.7) 2(-0.635,-2.7) 3(0.635,-2.7) 4(1.905,-2.7) 5(1.905,2.7) 6(0.635,2.7) 7(-0.635,2.7) 8(-1.905,2.7)
  rect 3.1x2.6 smd: 9(0,0)

## Nets
3V3: C152.1 C159.1 C167.1 C176.1 C177.1 C179.1 L12.1 R48.1 U38.1 U38.2
5V: C157.1 C158.1 C178.1 C186.1 C187.1 C200.1 L11.2 NOREF#8.1 R47.1 U16.6 U16.7
GND: C152.2 C157.2 C158.2 C159.2 C161.1 C167.2 C176.2 C177.2 C178.2 C179.2 C186.2 C187.2 C189.1 C191.1 C192.1 C193.1 C196.1 C197.1 C199.1 C200.2 C201.1 D3.1 D4.2 D5.2 NOREF#2.1 NOREF#3.3 NOREF#4.1 NOREF#5.1 NOREF#6.4 NOREF#7.1 R49.2 R50.2 U11.6 U11.9 U16.1 U16.4 U16.8 U16.9 U16.10 U16.11 U16.12 U16.13 U16.14 U16.15 U16.16 U16.17 U16.18 U28.6 U28.9 U38.3 U38.4 U38.5 U38.6 U39.1 U39.4 U39.5 U39.6 U40.3 U40.4 U40.5 U40.6 U41.1
VIN: C161.2 C189.2 C191.2 C192.2 C193.2 C196.2 C197.2 C199.2 C201.2 D3.2 NOREF.1 U11.7 U28.7 U40.1 U40.2 U41.2
D+: U16.2 U39.3
D-: U16.3 U39.2
FB: R47.2 R49.1 U11.4
$1N1948: C100.2 D4.1 L11.1 U11.8
$1N1949: C100.1 U11.1
$1N1954: C143.2 U28.1
$1N1955: C143.1 D5.1 L12.2 U28.8
$1N1978: R48.2 R50.1 U28.4

Pads without a net: U11 2 3 5; U16 5; U28 2 3 5

## Via types
v1: diameter 0.4, hole 0.3, Top Layer to Bottom Layer, 103 vias

## Routing (per net, layer and track width the routed paths; a pad name or vN(x,y) marks a point on that pad's centre or on a via; arc(x,y) is an arc through that point)
3V3: length 70
  Top Layer w0.312: v1(6.14,25.95) 6.14,30.05 arc(6.33,31.02) 6.88,31.85 v1(7.43,32.39)
  Top Layer w1: 33.32,11.82 33.32,31.38 arc(32.57,33.17) 30.78,33.92 17.82,33.92
  Bottom Layer w0.5: 33.77,10.9 33.77,12.32 arc(33.76,12.34) 33.75,12.34 ; 34.09,12.4 32.19,12.4 ; 34.09,12.4 34.1,12.4 34.1,10.74 34.07,10.74 ; 34.09,12.4 33.58,12.4 arc(33.55,12.39) 33.53,12.36 ; 34.07,10.74 32.22,10.71 32.22,11.48 ; 34.07,10.74 32.9,10.74
  Bottom Layer w1: 32.49,12.12 32.49,11.03 arc(32.49,11.02) 32.49,11.02 ; 32.57,11.51 33.68,11.51 ; v1(7.43,32.39) 7.82,32.39 arc(8.79,32.59) 9.62,33.14 C179.1 arc(10.21,33.51) 10.37,33.47 C159.1 C176.1 C177.1 C152.1 C167.1 17.06,33.47 arc(17.32,33.51) 17.57,33.6 arc(17.7,33.69) 17.82,33.79
  vias: v1(17.58,34.14) v1(17.59,33.56) v1(18.18,34.13) v1(18.18,33.54) v1(33.21,12.16) v1(33.21,10.93) v1(33.96,10.93) v1(34,12.16)
5V: length 87
  Top Layer w0.2: NOREF#8.1 31.41,4.19 arc(31.41,4.2) 31.4,4.2
  Top Layer w0.312: 20.68,32.44 v1(20.69,32.45) 20.69,32.45 v1(20.69,32.97) ; v1(20.12,32.97) 20.12,32.45 ; v1(32.81,35.06) 34.59,35.06 arc(36.38,34.32) 37.13,32.52 37.13,25.25 arc(37.06,24.92) v1(36.87,24.64)
  Top Layer w1: 20.12,32.66 20.13,32.65 29,32.65 arc(30.53,32.01) 31.16,30.49 31.16,11.31 arc(31.72,9.96) 33.06,9.41 33.44,9.41 arc(34.34,9.03) 34.71,8.14 34.71,5.47 arc(34.27,4.39) 33.19,3.95 32.17,3.95 arc(31.77,4.01) 31.4,4.2 arc(31.04,4.65) 30.9,5.22 arc(30.46,6.28) 29.4,6.72 28.62,6.72 arc(27.14,6.11) 26.51,4.63 ; U16.6 26.28,4.56 arc(26.4,4.58) 26.51,4.63 ; 26.51,4.63 arc(26.54,4.66) 26.57,4.68 ; 26.51,4.63 arc(26.51,4.62) 26.51,4.61
  Bottom Layer w0.312: L11.2 31.39,33.64 v1(32.81,35.06)
  Bottom Layer w1: L11.2 28.89,33.28 arc(28.81,33.3) C178.1 28.72,33.37 arc(27.9,33.92) 26.92,34.11 C200.1 C186.1 C187.1 C157.1 C158.1 21.82,34.11 arc(21.31,34.02) 20.87,33.75 arc(20.59,33.43) 20.42,33.05 arc(20.4,32.98) 20.39,32.92 arc(20.39,32.91) 20.38,32.9 arc(20.38,32.85) 20.37,32.81 arc(20.36,32.73) 20.36,32.65
  vias: v1(20.12,32.44)
GND: length 458.6
  Top Layer w0.2: 30.32,3.13 NOREF#2.1 ; 30.32,3.13 30.25,3.2 ; 30.32,3.13 30.42,3.24 arc(30.46,3.26) 30.51,3.27 ; 30.32,3.13 30.26,3.07 30.17,2.98 ; 30.25,3.2 29.03,4.42 arc(28.91,4.6) U16.8 ; 30.25,3.2 30.46,3.41 arc(30.46,3.42) 30.47,3.42 ; 30.25,3.2 30.12,3.07 ; 4.15,10.72 3.97,10.72 arc(3.62,10.65) 3.32,10.45 ; 4.15,10.72 4.44,10.72 arc(4.58,10.69) 4.7,10.61 4.85,10.47 ; 4.15,10.72 arc(4.02,10.75) 3.89,10.76 3.8,10.76 ; 4.15,10.72 arc(4.42,10.61) 4.65,10.44 ; 30.81,6.93 30.84,6.89 ; 30.84,6.89 31.55,6.19 31.68,6.19 arc(31.84,6.09) 32.03,6.05 ; 30.84,6.89 30.64,7.1 arc(30.12,7.45) 29.5,7.58
  Top Layer w0.312: U16.1 12.79,4.4 arc(12.76,4.77) 12.65,5.11 arc(11.98,5.93) 10.96,6.23 4.23,6.23 arc(2.89,6.79) 2.33,8.14 2.33,9.38 arc(2.57,10.36) 3.23,11.13 arc(3.82,11.43) U16.18 arc(4.85,11.39) 5,11.02 5,9.66 arc(5.55,8.31) 6.9,7.76 17.14,7.76 arc(18.82,7.12) 19.66,5.53 arc(19.68,5.37) 19.68,5.22
  Top Layer w0.8: 4.06,2.26 4.06,1.65 arc(4.36,1.4) 4.71,1.22 ; 4.06,2.26 4.06,2.33 arc(3.95,3.04) 3.64,3.69 ; 4.06,2.26 3.51,2.26 arc(3.05,2.35) 2.67,2.61 ; 4.06,2.26 5.5,2.26 ; 0.85,3.83 1.24,3.83 ; 1.24,3.83 1.89,3.83 ; 1.24,3.83 arc(1.45,3.19) 1.85,2.65 ; 1.24,3.83 arc(1.21,4.03) 1.2,4.22 1.2,4.91 ; 12.98,3.14 11.84,3.14 11.84,4.66 arc(11.98,4.98) 12.3,5.11 13.2,5.11 arc(13.46,5.01) 13.56,4.75 13.56,3.96 ; 12.98,3.14 11.66,1.83 arc(10.84,1.28) 9.87,1.08 5.42,1.08 arc(5.06,1.12) 4.71,1.22 ; 12.98,3.14 13.66,3.14 13.66,3.94 ; 12.98,3.14 13.08,3.24 ; 36.41,15.46 36.41,13.95 36.23,13.95 ; 16.04,35.19 17.83,35.19 ; 17.83,35.19 U16.14 ; 17.83,35.19 21.25,35.19 21.25,36 17.95,36 ; 19.68,5.53 19.66,5.53 ; 19.68,5.53 19.68,4.36 ; 19.68,5.53 19.81,5.53 ; 29.24,3.72 29.33,3.63 ; 29.33,3.63 30.2,2.76 arc(30.24,2.72) 30.29,2.67 arc(31.08,2.19) 31.99,2.02 38.61,2.02 ; 29.33,3.63 29.69,3.63 29.69,5.37 ; 29.33,3.63 28.85,3.63 28.85,3.73 ; 5.84,37.82 4.07,37.82 arc(3.55,37.92) 3.12,38.21 ; 2.89,37.67 3.86,37.67 arc(4.83,37.47) 5.66,36.92 6.24,36.34 ; 29.47,4.36 28.85,3.73 ; 30.58,3.07 29.98,3.07 ; 37.91,3.23 38.16,3.48 arc(38.55,4.06) 38.68,4.74 ; 34.98,38.42 36.61,38.42 arc(37.01,38.5) 37.35,38.72 ; 1.89,3.83 1.89,4.93 arc(1.95,5.2) 2.1,5.42 ; 1.89,3.83 2.52,3.83 ; 1.89,3.83 1.89,2.97 ; 28.85,3.73 28.72,3.6 ; 28.85,3.73 28.85,4.85 ; 5.05,35.89 4.66,36.28 arc(4.2,36.58) 3.66,36.69 ; 19.64,4.36 19.68,4.36 ; 19.68,4.36 U16.4 ; 2.71,29.41 2.71,24.95 arc(2.83,24.66) 3.12,24.54 4.29,24.54 arc(4.72,24.72) 4.91,25.16 4.91,28.45 arc(4.79,28.72) 4.53,28.83 3.19,28.83 arc(3.17,28.82) 3.16,28.81 3.16,26.33 4.41,26.33 arc(4.41,26.33) 4.42,26.34 4.42,27.26 3.47,27.26 ; U16.14 17.83,36 17.95,36 ; U16.14 17.95,35.99 17.95,36 ; U16.14 20.49,35.87 20.49,35.44 ; 37.3,16.72 35.01,16.72 35.01,12.26 36.88,12.26 36.88,16.19 ; 28.72,3.6 27.19,2.07 arc(26.37,1.52) 25.39,1.33 15.71,1.33 arc(14.73,1.52) 13.91,2.07 12.96,3.03 ; 28.72,3.6 28.1,3.6 28.1,4.72 ; 28.72,3.6 28.75,3.6 ; 34.09,37.62 36.24,37.62 arc(36.85,37.74) 37.37,38.09 ; 35.64,15.1 35.64,14.04 35.56,14.04 ; 4.71,1.22 3.46,1.22 arc(3.14,1.28) 2.87,1.47 ; 4.71,1.22 5.36,1.22 ; 2.52,3.83 2.84,3.83 arc(3.13,3.87) 3.41,3.99 ; 2.52,3.83 arc(2.58,3.9) 2.64,3.96 3.22,4.54 ; 2.52,3.83 arc(2.11,3.14) 1.98,2.36 ; 27.96,34.92 28.73,35.69 arc(28.89,35.93) 28.95,36.21 ; 36.83,11.05 36.93,11.15 36.93,13.78 arc(36.94,14.12) 36.96,14.45 ; 5.55,36.21 5.29,36.48 arc(4.58,36.95) 3.76,37.11 ; 3,3.04 3.62,3.66 arc(3.63,3.67) 3.64,3.69 ; 4.34,38.05 4.2,38.19 arc(3.88,38.66) 3.77,39.22 3.23,39.22 arc(3,39.24) 2.78,39.3 0.7,39.3 0.7,36.67 arc(0.75,36.42) 0.89,36.21 3.61,36.21 3.72,36.1 arc(4.18,35.79) 4.72,35.68 ; 3.34,4.06 arc(3.37,4.02) 3.41,3.99 ; 3.41,3.99 arc(3.53,3.84) 3.64,3.69 ; 3.41,3.99 arc(3.52,4.06) 3.63,4.16 ; 3.64,3.69 arc(3.75,3.87) 3.79,4.08
  Top Layer w1: 34.67,30.09 34.67,30.63 36.05,30.63 ; 3.44,12.56 3.99,12.56 3.99,14.8 5.55,14.8 5.55,10.68 ; 4.58,13.44 4.9,13.44 4.9,12.24 ; 35.63,28.73 34.79,28.73 34.79,27.79 ; 36.08,26.32 34.61,26.32 34.61,26.31 ; 36.23,31.06 36.23,26.13 ; 35.71,29.08 35.71,28.08 35.16,28.08 35.16,27.37 ; 3.31,11.04 3.23,11.04 3.23,15.16
  Bottom Layer w0.2: U39.4 7.44,12.17 arc(7.69,12.06) 7.79,11.82 7.79,11.44 ; 7.37,12 7.42,12 arc(7.61,11.91) 7.7,11.72 ; 7.15,11.82 7.41,11.82 arc(7.6,11.74) 7.67,11.56 ; 19.47,33.54 19.47,34.68
  Bottom Layer w0.312: 5.22,8.42 4.59,8.42 arc(3.62,8.82) 3.22,9.79 arc(3.91,11.47) 5.6,12.17 ; 9.19,16.14 9.19,15.56 arc(9.09,15.34) v1(8.87,15.25) arc(9,15.3) 9.06,15.44 9.06,16.01 arc(8.84,15.92) 8.75,15.7 8.75,15.66 ; 21.76,32.27 21.88,32.39 arc(21.98,32.53) C158.2 ; 21.76,32.27 21.33,31.83 ; 21.76,32.27 26.5,32.27 arc(26.69,32.23) 26.85,32.12 ; 10.35,7.95 11.02,7.95 11.02,5.9 8.94,5.9 8.94,7.78 10.85,7.78 10.85,6.82 ; 21.33,31.83 26.14,32.09 ; 21.33,31.83 20.59,31.8 18.46,31.8 ; 21.33,31.83 arc(21.61,32.02) 21.94,32.09 26.14,32.09 ; 26.14,32.09 26.85,32.12 ; 8.03,16.3 7.78,16.56 arc(7.61,16.81) 7.56,17.1 ; 8.75,15.66 8.75,15.61 ; 8.75,15.66 arc(8.84,15.5) 8.87,15.31 ; 8.75,15.66 arc(8.55,15.83) 8.3,15.88 ; 26.85,32.12 29.12,32.24 ; 7.74,16.17 7.71,16.17 arc(7.37,16.31) 7.22,16.66 ; 8.68,16.01 8.58,16.01 arc(8.08,16.11) v1(7.66,16.39) arc(7.47,16.67) 7.41,17
  Bottom Layer w0.8: 10.49,6.19 10.62,6.19 10.62,4.03 ; 8.91,3.88 5.12,3.88 5.12,3.82 ; 8.91,3.88 8.91,5.01 10.08,5.01 ; 8.91,3.88 8.91,3.23 ; 16.77,5.35 16.99,5.35 ; 16.77,5.35 14.68,5.35 14.68,3 arc(15.1,2.91) 15.52,2.8 16.93,2.8 ; 16.77,5.35 16.77,5.85 17.11,5.98 17.19,5.98 ; 16.99,5.35 16.99,3.69 ; 16.99,5.35 17.31,5.35 17.31,5.47 ; 35.48,19.57 35.48,18.42 34.21,18.42 ; 35.48,19.57 35.48,20.84 31.92,20.84 31.92,19.57 ; 35.48,19.57 35.91,19.57 arc(35.96,19.59) 35.98,19.64 ; 35.48,19.57 U11.9 31.92,19.57 ; 5.22,8.42 U39.1 6.65,8.42 6.65,7.76 ; 35.98,19.64 35.98,19.31 arc(36.32,18.5) 37.13,18.17 38.27,18.17 ; 35.98,19.64 35.98,20.71 arc(36.24,21.34) 36.87,21.6 38.62,21.6 arc(38.62,21.6) 38.63,21.6 arc(38.64,21.58) 38.65,21.57 38.65,20.71 37.88,19.95 ; 4.17,4.77 4.17,4.38 v1(6.89,4.38) 8.69,4.38 ; 4.17,4.77 5.52,4.77 5.63,4.88 ; 4.17,4.77 4.17,5.67 ; 4.17,4.77 3.17,4.77 arc(2.69,5.78) 2.52,6.88 2.52,7.08 ; 34.21,18.42 34.21,19.19 arc(34.17,19.27) 34.08,19.31 ; 34.21,18.42 v1(34.21,16.77) 34.21,15.85 arc(34.53,15.05) U38.6 ; 34.21,18.42 31.92,18.42 31.92,19.57 ; 34.71,8.42 U38.4 32.83,9.04 ; 32.4,9.73 32.4,8.42 ; 4.23,12.33 4.23,13.6 ; 4.23,13.6 4.23,15.76 2.58,15.76 2.58,13.6 4.23,13.6 ; 4.23,13.6 5.25,13.6 ; v1(8.87,13.85) v1(8.87,15.25) ; 7.66,8.56 7.66,7.76 6.65,7.76 ; 1.54,1.55 3.02,1.55 arc(3.99,1.75) 4.82,2.3 5.5,2.98 ; v1(7.41,17.25) 7.41,19.95 v1(6.77,19.95) ; 20.62,4.2 20.62,5.85 arc(20.58,5.94) 20.49,5.98 17.7,5.98 17.7,3.82 18.71,3.82 ; 10.08,5.01 10.08,8.52 ; 10.08,5.01 NOREF#4.1 ; 10.08,5.01 10.14,5.01 ; 32.83,9.04 34.71,9.04 ; 32.83,9.04 U38.3 34.71,9.67 ; 36.5,7.03 33.72,7.03 33.72,4.59 36.21,4.59 arc(36.66,5.4) 36.9,6.29 36.9,7.85 ; C158.2 C157.2 C200.2 27.09,32.71 ; 8.13,4.6 8.13,5.94 5.77,5.94 5.77,4.55 ; 36.75,15.7 36.8,15.7 36.8,13.03 ; 5,12.2 5,12.17 U39.4 6.63,12.45 6.6,12.45 6.6,12.71 5.5,12.71 ; 21.38,9.79 22.78,9.79 C191.1 C197.1 C193.1 29.22,9.77 arc(29.41,9.81) C199.1 ; 1.32,2.74 1.32,2.75 arc(1.51,3.72) 2.06,4.54 2.73,5.2 ; C199.1 C201.1 29.57,7.37 ; C199.1 v1(29.57,10.11) ; 36.76,13.58 33.95,13.58 33.95,13.97 ; 33.98,14.83 33.87,14.83 33.95,13.97 ; 22.78,2.8 22,2.8 ; 22,2.8 21.86,2.66 arc(21.9,2.76) 22,2.8 ; 22,2.8 C161.1 C196.1 C192.1 29.51,3.58 ; 22,2.8 22,3.95 ; 5.79,6.12 5.79,6.95 2.83,6.95 2.83,6.36 ; 5.39,3.23 8.47,3.23 8.55,3.31 ; 6.65,7.76 5.76,7.76 ; 5.76,13.09 5.76,15.05 ; 4.91,4.14 4.32,3.55 arc(3.81,3.17) 3.22,2.93 ; 34.59,17.53 34.59,15.63 arc(34.62,15.54) 34.71,15.5 ; 36.62,16.9 36.62,16.26 arc(36.51,15.99) 36.24,15.88 ; 33.95,13.97 33.95,14.09 ; 18.14,2.65 17.97,2.82 17.3,2.82 U40.6 ; 3.28,4.63 3.28,3.42 arc(3.26,3.17) 3.22,2.93 ; 3.22,2.93 arc(2.93,2.88) 2.64,2.86 ; 3.22,2.93 arc(3.01,2.4) 2.67,1.94
  vias: v1(1.95,22.74) v1(2.46,12.45) v1(2.96,14.49) v1(3.6,16.52) v1(3.6,5.09) v1(4.87,35.19) v1(5.21,10.02) v1(5.28,3.37) v1(5.38,32.63) v1(5.38,29.79) v1(5.38,27.62) v1(5.81,14.42) v1(5.94,19.95) v1(6.08,13.26) v1(6.27,36.46) v1(6.77,20.84) v1(6.77,19.05) v1(7.5,29.79) v1(7.63,19.95) v1(7.79,25.91) v1(7.92,8.9) v1(8.08,34.99) v1(8.42,8.39) v1(8.75,20.07) v1(10.58,35.11) v1(14.01,10.04) v1(15.79,37.09) v1(15.92,35.57) v1(16.07,9.95) v1(17.03,10.04) v1(17.31,2.17) v1(17.57,2.67) v1(17.92,32.27) v1(18.97,32.27) v1(22.39,35.44) v1(22.65,37.69) v1(22.65,36.58) v1(24.04,10.11) v1(26.59,10.11) v1(27.86,10.11) v1(28.06,34.93) v1(29.89,31.12) v1(29.89,30.36) v1(30.74,35.32) v1(31.62,36.46) v1(32.17,31.12) v1(32.17,30.11) v1(32.34,20.48) v1(32.34,19.69) v1(32.34,18.77) v1(32.81,5.22) v1(33.19,5.85) v1(33.82,7.5) v1(33.97,33.28) v1(34.59,23.5) v1(34.84,36.46) v1(34.97,25.79) v1(34.97,20.49) v1(34.97,19.48) v1(34.97,18.68) v1(35.73,9.96) v1(35.73,8.52) v1(36.11,11.18) v1(36.19,25.94) v1(36.62,35.24) v1(36.62,30.36) v1(36.75,10.04) v1(37.51,16.9) v1(38.02,22.74)
VIN: length 76.2
  Top Layer w1: 8.66,11.92 8.66,10.63 arc(9.12,9.52) 10.23,9.06 29.05,9.06 arc(30.02,8.87) 30.85,8.32 v1(31.92,7.25)
  Bottom Layer w1: U11.7 32.94,16.43 arc(32.74,15.45) 32.19,14.63 31.77,14.21 arc(31.22,13.39) 31.03,12.42 31.03,10.06 arc(31.01,9.98) C199.2 C201.2 arc(31.13,7.67) 31.59,6.94 arc(31.62,6.91) 31.64,6.89 31.67,6.87 ; 12.56,6.85 U40.1 15.43,6.85 arc(16.4,7.04) 17.23,7.59 D3.2 20.03,8.52 arc(20.86,7.96) 21.83,7.77 C191.2 C161.2 C196.2 C197.2 C193.2 C192.2 30.89,5.58 arc(31.63,5.96) v1(31.92,6.74) ; 12.56,6.85 U40.2 ; 12.56,6.85 arc(12.6,6.83) 12.62,6.79 NOREF.1 ; U28.7 6.14,16.98 arc(6.27,16.32) 6.65,15.76 6.93,15.47 arc(7.18,15.31) C189.2 U41.2 arc(7.55,13.47) 7.76,13.15 7.87,13.05 arc(7.89,13.03) 7.91,13.01 8.63,12.28 arc(8.66,12.23) 8.68,12.18 arc(8.68,12.17) 8.68,12.17 8.68,11.95 ; 12.1,7.17 13.09,7.17 arc(13.22,7.14) 13.32,7.07
  vias: v1(8.38,12.2) v1(8.41,11.69) v1(8.93,12.2) v1(8.93,11.69) v1(32.45,6.74) v1(32.47,7.25)
D+: length 20.5
  Top Layer w0.312: v1(4.21,10.03) 3.84,10.03 arc(3.13,9.73) 2.84,9.03 2.84,8.12 arc(3.23,7.17) 4.18,6.78 13.25,6.78 arc(14.55,6.24) 15.09,4.94 15.09,4.08
  Bottom Layer w0.312: U39.3 6.15,10.92 arc(5.18,10.72) 4.36,10.17 v1(4.21,10.03)
D-: length 20.5
  Top Layer w0.312: v1(3.98,9.41) 3.68,9.41 arc(3.41,9.29) 3.3,9.03 arc(3.82,7.76) 5.08,7.24 14.34,7.24 arc(16.49,6.35) U16.3
  Bottom Layer w0.312: v1(3.98,9.41) 6,9.41 arc(6.34,9.47) U39.2
FB: length 4.1
  Bottom Layer w0.312: R47.2 36.55,22.8 arc(36.05,22.48) U11.4 35.48,24.45 arc(35.44,24.62) R49.1
$1N1948: length 19.3
  Bottom Layer w1: U11.8 31.39,17.04 arc(30.84,17.87) 30.65,18.84 30.65,26.78 arc(30.76,27.34) D4.1 31.25,27.82 arc(32.22,28.01) 33.04,28.56 34.75,30.27 arc(35.3,31.09) 35.49,32.07 L11.1
$1N1949: length 2.5
  Bottom Layer w0.312: U11.1 31.67,23.7 arc(31.78,24.28) C100.1
$1N1954: length 2.2
  Bottom Layer w0.312: U28.1 4.87,23.7 arc(4.75,24.28) C143.2
$1N1955: length 15.8
  Bottom Layer w1: 3.03,23.13 C143.1 3.03,27.29 arc(3.12,27.78) D5.1 3.4,32.21 arc(3.38,32.31) L12.2 ; 2.96,23.13 arc(3.13,22.3) 3.6,21.6 3.62,21.58 arc(4.17,20.76) 4.36,19.78 4.36,18.47 arc(4.49,17.81) U28.8
$1N1978: length 3.7
  Bottom Layer w0.312: R48.2 R50.1 8.07,24.12 arc(8.52,23.45) U28.4

## Copper pours and planes (outline as drawn; the poured copper is in the pictures)
3V3 on Top Layer: 32.82,12.62 34.33,12.62 34.33,10.69 32.82,10.69
3V3 on Top Layer: 17.34,34.4 18.43,34.4 18.43,33.31 17.34,33.31
3V3 on Bottom Layer: 17.34,34.4 18.42,34.4 18.42,33.3 17.34,33.3
3V3 on Bottom Layer: 32.05,12.62 34.32,12.62 34.32,10.47 32.05,10.47
5V on Top Layer: 19.86,33.08 20.97,33.08 20.97,32.05 19.86,32.05
5V on Bottom Layer: 19.85,33.24 20.97,33.24 20.97,32.19 19.85,32.19
GND on Top Layer: -6.18,43.06 44.62,43.06 44.62,-4.18 -6.18,-4.18
GND on Bottom Layer: -4.83,40.09 44,40.09 44,-7.7 -4.83,-7.7
VIN on Top Layer: 31.69,7.74 32.75,7.74 32.75,6.51 31.69,6.51
VIN on Top Layer: 8.16,12.44 9.19,12.44 9.19,11.44 8.16,11.44
VIN on Bottom Layer: 8.16,12.44 9.16,12.44 9.16,11.44 8.16,11.44
VIN on Bottom Layer: 31.09,7.55 32.69,7.55 32.69,5.98 31.09,5.98

Small or netless copper shapes (teardrops, artwork), in the pictures only: 42 on Top Layer, 126 on Bottom Layer

## Text on the board
Bottom Silkscreen Layer: G | D+ | D- | 3 | 5 | -- | ++ | 3.3V | GND
Top Silkscreen Layer: G | 5 | 25.5x25.5

# Board PCB1_ground
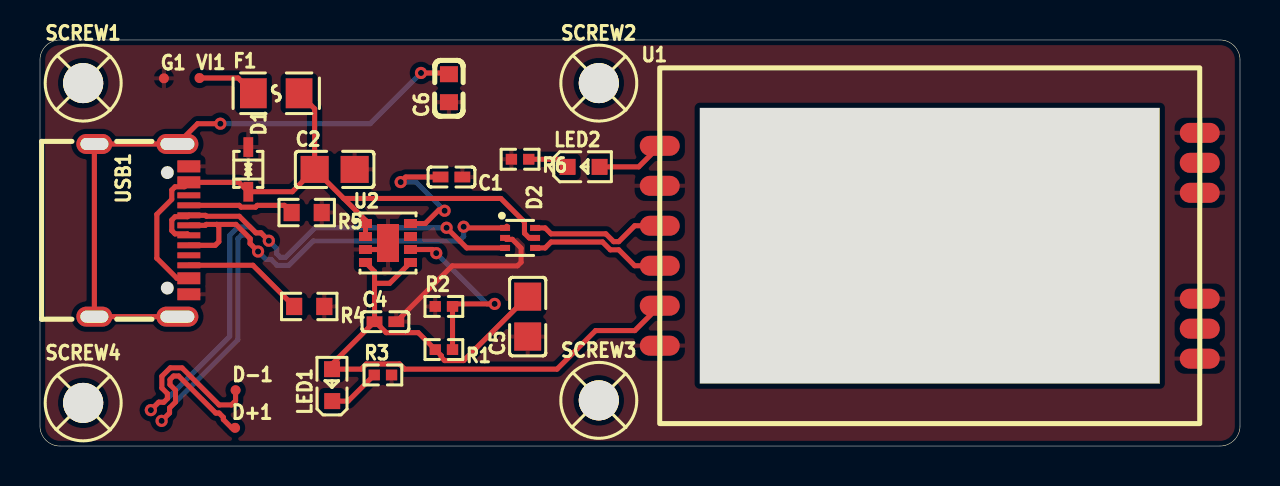
[diagram p4: board, top side]
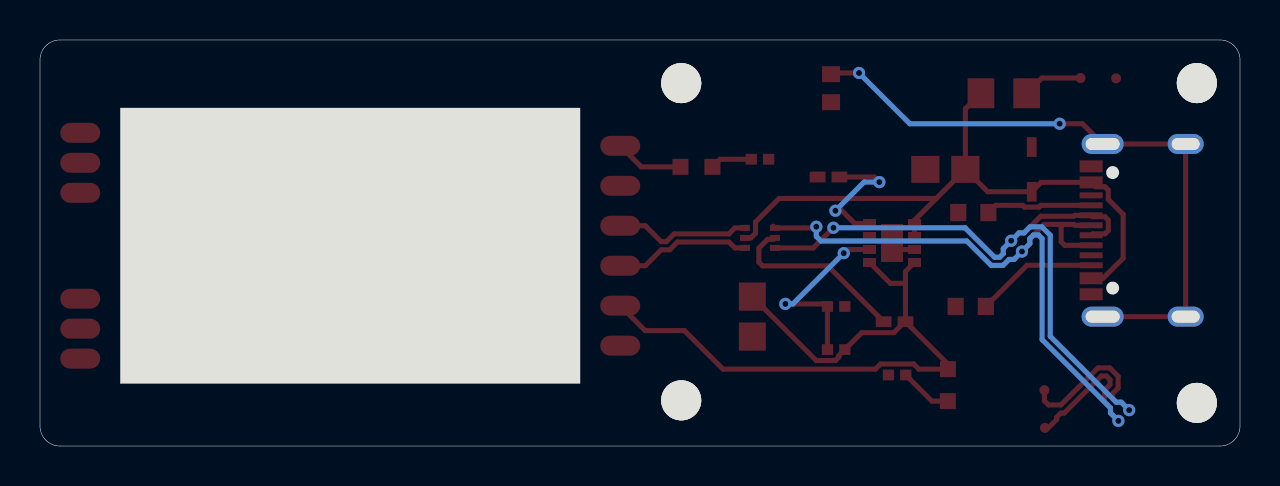
[diagram p5: board, bottom side, seen from below]

Outline 60 x 20.32 mm; copper layers: Top Layer, Bottom Layer. Coordinates in mm from the lower left corner of the outline.
Outline path: 0,19.32 0,1 arc(0.29,0.29) 1,0 59,0 arc(59.71,0.29) 60,1 60,19.32 arc(59.71,20.03) 59,20.32 1,20.32 arc(0.29,20.03) 0,19.32
Stack: Top Layer 0.035mm / Dielectric1 1.51mm FR4 er 4.5 / Bottom Layer 0.035mm

## Design rules (mm)
net USB_D+: DP1
net USB_D-: DP1
net USB_DM: DP2
net USB_DP: DP2
template: JLCPCB Capability(Two Layers Board)
spacing copperThickness1oz (default): track to track 0.102, other pairs 0.152 to 0.3
spacing copperThickness2oz: track to track 0.203, other pairs 0.152 to 0.3
track width copperThickness1oz (default): min 0.127, default 0.254, max 2.54
track width copperThickness2oz: min 0.203, default 0.254, max 2.54
differential pair differentialPair (default): width min 0.127, default 0.254, max 2.54; gap min 0.152, default 0.152
via viaSize (default): diameter min 0.5, default 0.61, max 10; hole min 0.3, default 0.305, max 6.3

## Placement (name value [footprint] x y rotation side)
C1  10nF  [C0402]  20.57 13.46 180 top
C2  22uF  [C0805]  14.73 13.84 0 top
C4  10nF  [C0402]  17.27 6.22 0 top
C5  22uF  [C0805]  24.38 6.48 90 top
C6  10uF  [C0603]  20.45 17.91 90 top
D1  PESD12VL1BA-N  [SOD-323_L1.8-W1.3-LS2.5-BI]  10.41 13.84 270 top
D2  USBLC6-2P6  [SOT-666-6_L1.6-W1.2-P0.50-LS1.6-BL]  24 10.41 270 top
D+1  -  [Test-Point-0.5mm]  9.75 0.91 0 top
D-1  -  [Test-Point-0.5mm]  9.78 2.79 0 top
F1  BSMD0805-075-12V  [F0805]  11.81 17.65 0 top
G1  -  [Test-Point-0.5mm]  6.2 18.4 0 top
LED1  NCD0603R1  [LED0603-RD_RED]  14.6 3.05 90 top
LED2  NCD0603G1  [LED0603-RD]  27.18 13.97 0 top
R1  47kΩ  [R0402]  20.19 4.83 180 top
R2  15kΩ  [R0402]  20.19 6.98 0 top
R3  1kΩ  [R0402]  17.15 3.56 0 top
R4  5.1kΩ  [R0603]  13.46 6.98 180 top
R5  5.1kΩ  [R0603]  13.34 11.68 180 top
R6  1kΩ  [R0402]  24 14.35 180 top
SCREW1  -  [M2螺丝]  2.16 18.16 0 top
SCREW2  -  [M2螺丝]  27.94 18.16 0 top
SCREW3  -  [M2螺丝]  27.94 2.29 0 top
SCREW4  -  [M2螺丝]  2.16 2.16 0 top
U1  -  [BL-R8812AF1-C]  30.99 18.92 0 top
U2  TPS82130SILR  [USIP-8_L3.0-W2.8-P0.65-TL-EP]  17.4 10.16 0 top
USB1  TYPE-C16PIN  [USB-C-SMD_TYPE-C16PIN]  5.08 10.79 270 top
VI1  -  [Test-Point-0.5mm]  7.98 18.42 0 top

## Footprints (pads in the part's own frame, mm; a bottom-side part is the same pattern mirrored in y, then rotated)
BL-R8812AF1-C
  rrect 2x1 smd: 1(0,-13.9) 2(0,-11.9) 3(0,-9.9) 4(0,-7.9) 5(0,-5.9) 6(0,-3.9) 7(27,-3.25) 8(27,-4.75) 9(27,-6.25) 10(27,-11.55) 11(27,-13.05) 12(27,-14.55)
C0402
  rect 0.79x0.54 smd: 1(-0.545,0) 2(0.545,0)
C0603
  rect 0.8x0.9 smd: 1(-0.7,0) 2(0.7,0)
C0805
  rect 1.41x1.35 smd: 1(-1,0) 2(1,0)
F0805
  rect 1.335x1.5 smd: 1(-1.143,0) 2(1.143,0)
LED0603-RD
  rect 0.8x0.8 smd: 1(-0.799,0) 2(0.799,0)
LED0603-RD_RED
  rect 0.8x0.8 smd: 1(-0.799,-0.004) 2(0.799,0.004)
M2螺丝
  round 2 hole 2: 1(0,0)
R0402
  rect 0.566x0.54 smd: 1(-0.433,0) 2(0.433,0)
R0603
  rect 0.806x0.864 smd: 1(-0.753,0) 2(0.753,0)
SOD-323_L1.8-W1.3-LS2.5-BI
  rect 0.985x0.49 smd: 1(-1.117,0) 2(1.117,0)
SOT-666-6_L1.6-W1.2-P0.50-LS1.6-BL
  rect 0.3x0.5 smd: 1(-0.5,-0.75) 2(0,-0.75) 3(0.5,-0.75) 4(0.5,0.75) 5(0,0.75) 6(-0.5,0.75)
Test-Point-0.5mm
  round 0.5 smd: 1(0,0)
USB-C-SMD_TYPE-C16PIN
  oval 1x2.1 hole 0.6x1.7: 1(-4.32,1.788) 2(4.32,1.788)
  oval 1x1.8 hole 0.6x1.4: 3(-4.32,-2.362) 4(4.32,-2.362)
  rect 0.6x1.15 smd: A1B12(-3.2,2.362) A4B9(-2.4,2.362) B1A12(3.2,2.362) B4A9(2.4,2.362)
  rect 0.3x1.15 smd: A5(-1.25,2.362) A6(-0.25,2.362) A7(0.25,2.362) A8(-1.75,2.362) B5(1.75,2.362) B6(0.75,2.362) B7(-0.75,2.362) B8(1.25,2.362)
USIP-8_L3.0-W2.8-P0.65-TL-EP
  rect 0.65x0.45 smd: 1(-1.125,0.975) 2(-1.125,0.325) 3(-1.125,-0.325) 4(-1.125,-0.975) 5(1.125,-0.975) 6(1.125,-0.325) 7(1.125,0.325) 8(1.125,0.975)
  rect 1.1x1.9 smd: 9(0,0)

## Nets
As in the schematic.

Pads without a net: SCREW1 1; SCREW2 1; SCREW3 1; SCREW4 1; U1 8 11; U2 7; USB1 A8 B8

## Via types
v1: diameter 0.61, hole 0.305, Top Layer to Bottom Layer, 12 vias

## Routing (per net, layer and track width the routed paths; a pad name or vN(x,y) marks a point on that pad's centre or on a via; arc(x,y) is an arc through that point)
3V3: length 36.4
  Top Layer w0.254: 16.27,9.18 16.73,8.73 16.73,8.14 ; 16.73,8.14 17.48,8.14 18.52,9.18 ; 16.73,8.14 C4.1 ; C4.1 16.76,6.22 17.31,5.67 18.91,5.67 R1.2 20.06,4.52 20.06,4.44 20.23,4.28 21.18,4.28 C5.2 ; C4.1 14.6,4.1 LED1.2 16.06,3.85 16.31,4.1 17.98,4.1 18.23,3.85 25.85,3.85 27.78,5.78 29.74,5.78 30.99,7.02
GND: length 10.5
  Top Layer w0.254: D2.2 23.32,10.34 23.62,10.34 24.06,9.91 24.06,9.2 23.88,9.02 20.61,9.02 C4.2 ; U2.9 17.07,9.83 U2.3
VIN_CON: length 3
  Top Layer w0.254: F1.1 9.91,18.42 VI1.1
USB_D+: length 39.7
  Top Layer w0.254: USB1.B6 8.76,10.04 8.94,10.22 8.94,10.99 8.84,11.09 ; 8.84,11.09 9.8,11.09 10.51,10.38 10.51,10.13 v1(10.9,9.73) ; 8.84,11.09 8.32,11.09 8.27,11.04 USB1.A6 ; v1(21.18,10.97) 21.24,10.91 D2.1 ; 23.34,11 23.37,10.97 ; D+1.1 9.59,0.91 9.17,1.33 9.17,1.44 8.96,1.65 8.79,1.65 6.93,3.5 6.68,3.5 6.5,3.32 6.5,3.07 6.78,2.79 6.78,2.2 6.48,1.9 6.48,1.65 v1(6.08,1.26)
  Bottom Layer w0.254: v1(21.18,10.97) 21.18,10.49 20.96,10.26 13.66,10.26 12.44,9.04 11.85,9.04 11.55,9.34 11.3,9.34 v1(10.9,9.73) 10.51,10.13 10.51,10.38 10.33,10.56 10.07,10.56 9.89,10.38 9.89,5.32 6.48,1.9 6.48,1.65 v1(6.08,1.26)
USB_D-: length 40.8
  Top Layer w0.254: v1(5.54,1.8) 5.94,2.19 6.19,2.19 6.37,2.37 6.37,2.63 6.09,2.9 6.09,3.49 6.51,3.91 7.1,3.91 8.96,2.06 9.57,2.06 9.78,2.26 D-1.1 ; v1(11.44,10.27) 11.05,10.67 10.79,10.67 9.97,11.5 8.32,11.5 8.27,11.54 USB1.B7 7.37,11.47 6.75,11.47 6.59,11.31 6.59,10.78 6.75,10.62 7.37,10.62 USB1.A7 ; v1(20.33,10.92) 21.34,9.91 D2.3
  Bottom Layer w0.254: v1(5.54,1.8) 5.94,2.19 6.19,2.19 9.49,5.49 9.49,10.55 9.91,10.97 10.5,10.97 10.79,10.67 11.05,10.67 v1(11.44,10.27) 11.84,9.88 11.84,9.63 12.02,9.45 12.27,9.45 13.75,10.92 v1(20.33,10.92)
USB_DM: length 6.9
  Top Layer w0.254: 30.99,9.02 29.73,9.02 28.94,9.82 28.51,9.82 28.12,10.21 25.55,10.21 25.26,9.91 D2.4
USB_DP: length 6.9
  Top Layer w0.254: D2.6 25.26,10.91 25.55,10.62 28.29,10.62 28.68,10.23 28.94,10.23 29.73,11.02 30.99,11.02
USB_VBUS: length 33
  Top Layer w0.254: D2.5 24.46,10.41 24.22,10.65 24.22,11.21 23.05,12.39 15.19,12.39 ; U2.2 U2.1 16.27,11.3 15.19,12.39 ; C2.1 13.73,16.87 F1.2 ; C2.1 12.61,12.73 D1.2 9.94,13.19 USB1.A4B9 7.22,12.97 6.75,12.97 6.59,12.81 6.59,12.34 5.84,11.59 5.84,9.4 6.84,8.39 7.44,8.39 ; C2.1 15.19,12.39
$1N1281: length 2.6
  Top Layer w0.254: LED1.1 15.4,2.25 R3.1
$1N1283: length 9.7
  Top Layer w0.254: R1.1 R2.2 20.75,7.11 v1(22.73,7.11) ; v1(19.81,9.65) 19.63,9.83 U2.6
  Bottom Layer w0.254: v1(22.73,7.11) 22.35,7.11 v1(19.81,9.65)
$1N1284: length 6.9
  Top Layer w0.254: 20.03,13.46 18.29,13.46 v1(18.03,13.21) ; U2.8 19.26,11.13 19.94,11.81 20.19,11.81 v1(20.23,11.77)
  Bottom Layer w0.254: v1(18.03,13.21) 18.8,13.21 v1(20.23,11.77)
$1N1301: length 5.4
  Top Layer w0.254: R5.2 12.22,12.04 10.87,12.04 10.77,11.95 10.05,11.95 9.96,12.04 USB1.A5
$1N1302: length 6.1
  Top Layer w0.254: USB1.B5 10.65,9.04 R4.2
$1N1320: length 2.1
  Top Layer w0.254: R6.1 26,14.35 LED2.1
$1N1321: length 3.4
  Top Layer w0.254: 30.99,15.02 29.94,13.97 LED2.2
$1N1322: length 32
  Top Layer w0.254: v1(9.02,16.13) 7.88,16.13 6.87,15.11 2.72,15.11 USB1.4 USB1.2 ; v1(19.05,18.67) 20.38,18.67 C6.2
  Bottom Layer w0.254: v1(9.02,16.13) 16.51,16.13 v1(19.05,18.67)

## Copper pours and planes (outline as drawn; the poured copper is in the pictures)
GND on Top Layer: -4.19,25.65 67.18,25.65 67.18,-8.89 -4.19,-8.89
